# EAGLE schematic comando 24V (EAGLE 9.6.1)

## Sheet 1 of 13
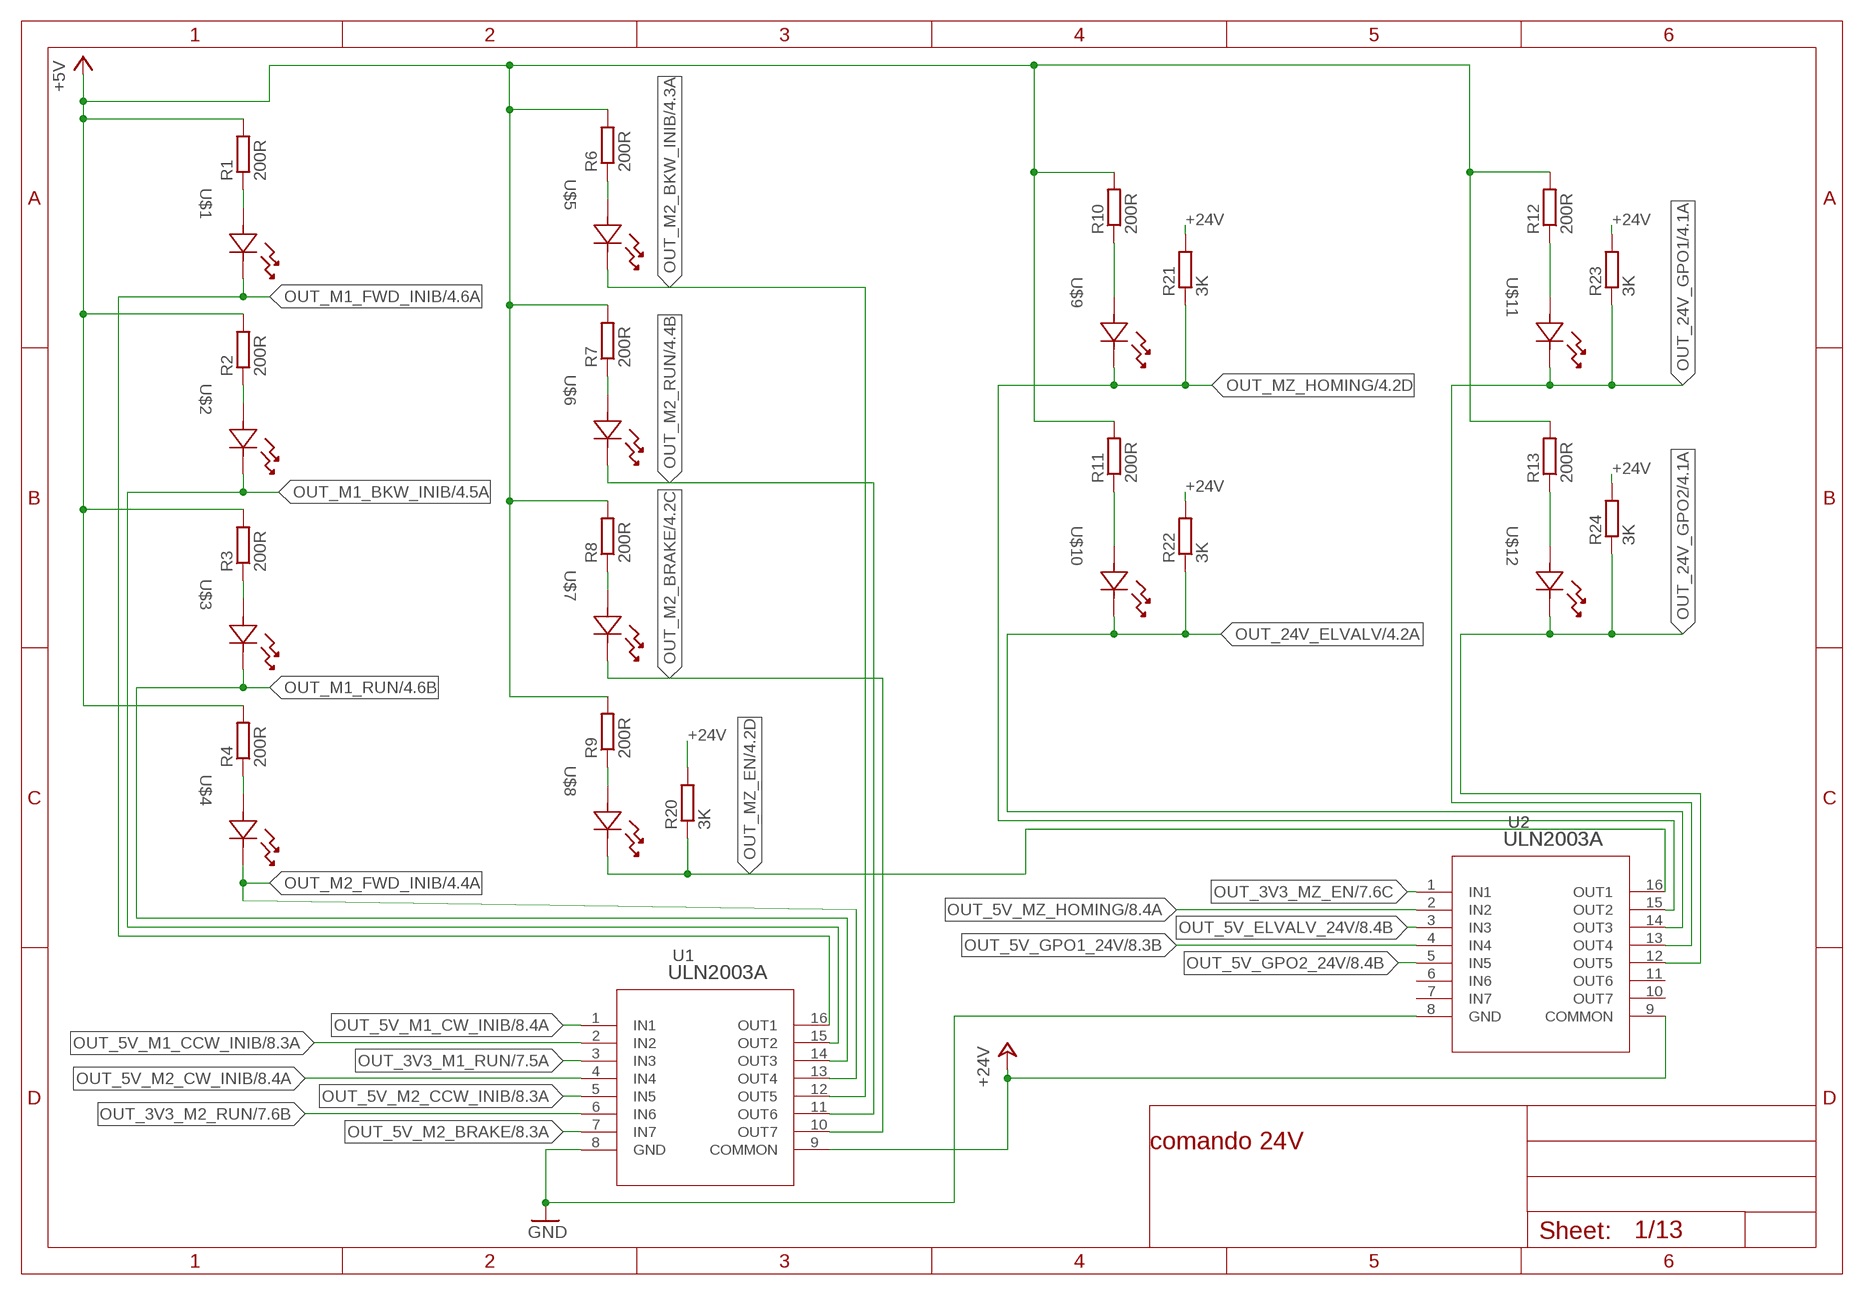
[diagram p0: schematic, sheet 1]

### Parts
R1  200R  R-EU_207/100207/10  [0207/10]
R2  200R  R-EU_207/100207/10  [0207/10]
R3  200R  R-EU_207/100207/10  [0207/10]
R4  200R  R-EU_207/100207/10  [0207/10]
R6  200R  R-EU_207/100207/10  [0207/10]
R7  200R  R-EU_207/100207/10  [0207/10]
R8  200R  R-EU_207/100207/10  [0207/10]
R9  200R  R-EU_207/100207/10  [0207/10]
R10  200R  R-EU_207/100207/10  [0207/10]
R11  200R  R-EU_207/100207/10  [0207/10]
R12  200R  R-EU_207/100207/10  [0207/10]
R13  200R  R-EU_207/100207/10  [0207/10]
R20  3K  R-EU_207/100207/10  [0207/10]
R21  3K  R-EU_207/100207/10  [0207/10]
R22  3K  R-EU_207/100207/10  [0207/10]
R23  3K  R-EU_207/100207/10  [0207/10]
R24  3K  R-EU_207/100207/10  [0207/10]
U1  ULN2003A  [DIP-16_STM]
U2  ULN2003A  [DIP-16_STM]
U$1  LED_TONDO  [LED_TONDO]
U$2  LED_TONDO  [LED_TONDO]
U$3  LED_TONDO  [LED_TONDO]
U$4  LED_TONDO  [LED_TONDO]
U$5  LED_TONDO  [LED_TONDO]
U$6  LED_TONDO  [LED_TONDO]
U$7  LED_TONDO  [LED_TONDO]
U$8  LED_TONDO  [LED_TONDO]
U$9  LED_TONDO  [LED_TONDO]
U$10  LED_TONDO  [LED_TONDO]
U$11  LED_TONDO  [LED_TONDO]
U$12  LED_TONDO  [LED_TONDO]

### Nets
+5V [supply]: R1.2 R2.2 R3.2 R4.2 R6.2 R7.2 R8.2 R9.2 R10.2 R11.2 R12.2 R13.2 ; also sheet 2,3,5,8,9,10,11,12
+24V [supply]: R20.2 R21.2 R22.2 R23.2 R24.2 U1.9(COMMON) U2.9(COMMON) ; also sheet 2,3,4,5,9,10,11
GND [ground]: U1.8(GND) U2.8(GND) ; also sheet 2,3,4,5,6,7,8,9,10,11,12
N$1: R1.1 U$1.2
N$2: R2.1 U$2.2
N$3: R3.1 U$3.2
N$4: R4.1 U$4.2
N$5: R6.1 U$5.2
N$6: R7.1 U$6.2
N$7: R8.1 U$7.2
N$8: R9.1 U$8.2
N$10: R10.1 U$9.2
N$11: R11.1 U$10.2
N$12: R12.1 U$11.2
N$13: R13.1 U$12.2
OUT_3V3_M1_RUN: U1.3(IN3) ; also sheet 7
OUT_3V3_M2_RUN: U1.6(IN6) ; also sheet 7
OUT_3V3_MZ_EN: U2.1(IN1) ; also sheet 7
OUT_5V_ELVALV_24V: U2.3(IN3) ; also sheet 8
OUT_5V_GPO1_24V: U2.4(IN4) ; also sheet 8
OUT_5V_GPO2_24V: U2.5(IN5) ; also sheet 8
OUT_5V_M1_CCW_INIB: U1.2(IN2) ; also sheet 8
OUT_5V_M1_CW_INIB: U1.1(IN1) ; also sheet 8
OUT_5V_M2_BRAKE: U1.7(IN7) ; also sheet 8
OUT_5V_M2_CCW_INIB: U1.5(IN5) ; also sheet 8
OUT_5V_M2_CW_INIB: U1.4(IN4) ; also sheet 8
OUT_5V_MZ_HOMING: U2.2(IN2) ; also sheet 8
OUT_24V_ELVALV: R22.1 U2.14(OUT3) U$10.1 ; also sheet 4
OUT_24V_GPO1: R23.1 U2.13(OUT4) U$11.1 ; also sheet 4
OUT_24V_GPO2: R24.1 U2.12(OUT5) U$12.1 ; also sheet 4
OUT_M1_BKW_INIB: U1.15(OUT2) U$2.1 ; also sheet 4
OUT_M1_FWD_INIB: U1.16(OUT1) U$1.1 ; also sheet 4
OUT_M1_RUN: U1.14(OUT3) U$3.1 ; also sheet 4
OUT_M2_BKW_INIB: U1.12(OUT5) U$5.1 ; also sheet 4
OUT_M2_BRAKE: U1.10(OUT7) U$7.1 ; also sheet 4
OUT_M2_FWD_INIB: U1.13(OUT4) U$4.1 ; also sheet 4
OUT_M2_RUN: U1.11(OUT6) U$6.1 ; also sheet 4
OUT_MZ_EN: R20.1 U2.16(OUT1) U$8.1 ; also sheet 4
OUT_MZ_HOMING: R21.1 U2.15(OUT2) U$9.1 ; also sheet 4
Unconnected: U2.6(IN6) U2.7(IN7) U2.10(OUT7) U2.11(OUT6)

## Sheet 2 of 13
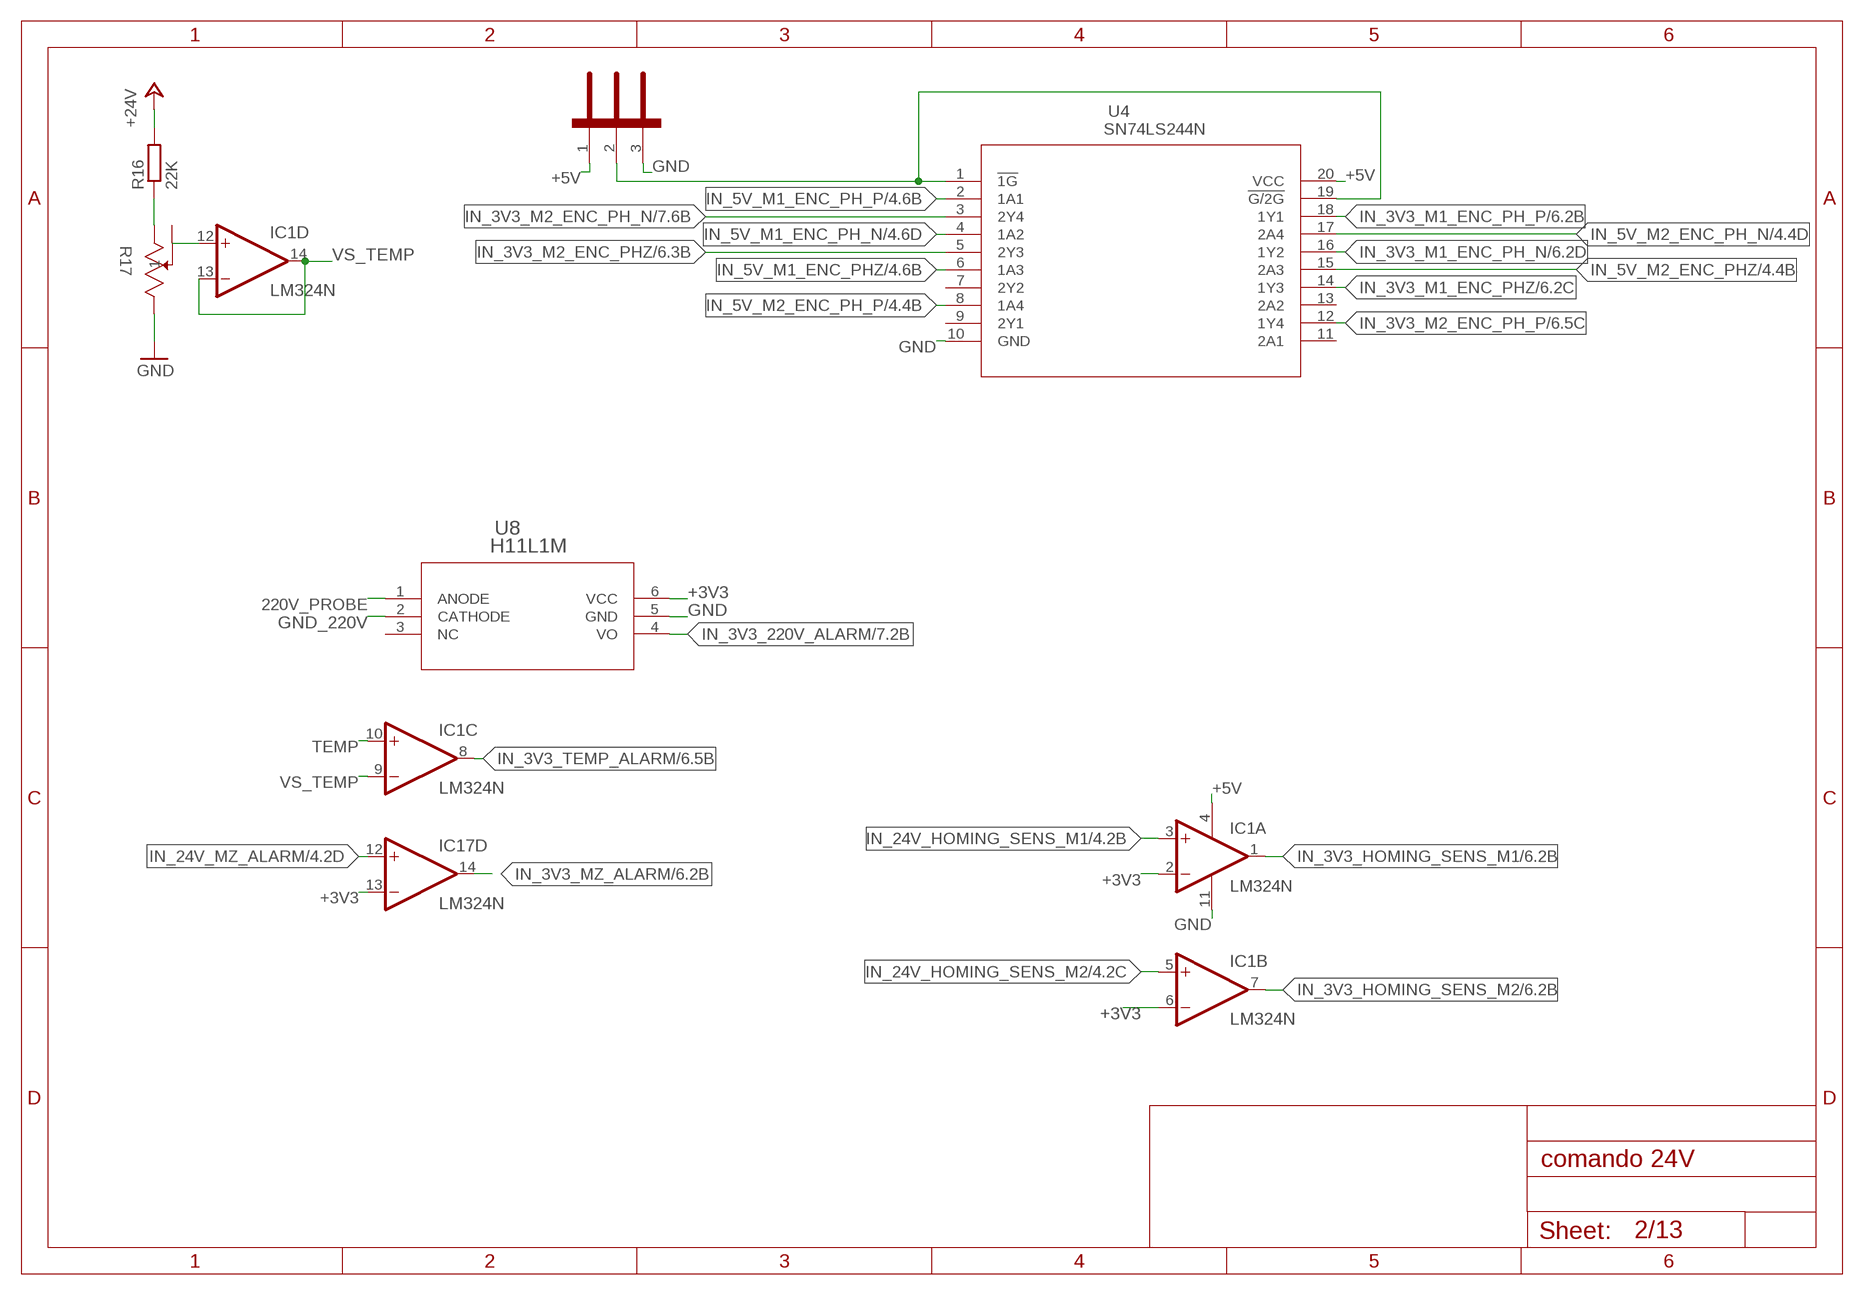
[diagram p1: schematic, sheet 2]

### Parts
EN_IN_ENC  STRIP_3  [STRIP_3]
IC1  LM324N  [DIL14]
IC17  LM324N  [DIL14]
R16  22K  R-EU_207/100207/10  [0207/10]
R17  TEMP_ADJ  64WR5KLF  [RES3_64W_TTE]
U4  SN74LS244N  [N20]
U8  H11L1M  [PDIP6-646BX_ONS]

### Nets
220V_PROBE: U8.1(ANODE) ; also sheet 3
+3V3 [supply]: IC1.2(A:-IN) IC1.6(B:-IN) IC17.13(D:-IN) U8.6(VCC) ; also sheet 3,4
+5V [supply]: EN_IN_ENC.1 IC1.4(P:V+) U4.20(VCC) ; also sheet 1,3,5,8,9,10,11,12
+24V [supply]: R16.2 ; also sheet 1,3,4,5,9,10,11
GND [ground]: EN_IN_ENC.3 IC1.11(P:V-) R17.3 U4.10(GND) U8.5(GND) ; also sheet 1,3,4,5,6,7,8,9,10,11,12
GND_220V [ground]: U8.2(CATHODE) ; also sheet 3
IN_3V3_220V_ALARM: U8.4(VO) ; also sheet 7
IN_3V3_HOMING_SENS_M1: IC1.1(A:OUT) ; also sheet 6
IN_3V3_HOMING_SENS_M2: IC1.7(B:OUT) ; also sheet 6
IN_3V3_M1_ENC_PH_N [high speed]: U4.16(1Y2) ; also sheet 6
IN_3V3_M1_ENC_PH_P [high speed]: U4.18(1Y1) ; also sheet 6
IN_3V3_M1_ENC_PHZ [high speed]: U4.14(1Y3) ; also sheet 6
IN_3V3_M2_ENC_PH_N [high speed]: U4.3(2Y4) ; also sheet 7
IN_3V3_M2_ENC_PH_P [high speed]: U4.12(1Y4) ; also sheet 6
IN_3V3_M2_ENC_PHZ [high speed]: U4.5(2Y3) ; also sheet 6
IN_3V3_MZ_ALARM: IC17.14(D:OUT) ; also sheet 6
IN_3V3_TEMP_ALARM: IC1.8(C:OUT) ; also sheet 6
IN_5V_M1_ENC_PH_N [high speed]: U4.4(1A2) ; also sheet 4
IN_5V_M1_ENC_PH_P [high speed]: U4.2(1A1) ; also sheet 4
IN_5V_M1_ENC_PHZ [high speed]: U4.6(1A3) ; also sheet 4
IN_5V_M2_ENC_PH_N [high speed]: U4.17(2A4) ; also sheet 4
IN_5V_M2_ENC_PH_P [high speed]: U4.8(1A4) ; also sheet 4
IN_5V_M2_ENC_PHZ [high speed]: U4.15(2A3) ; also sheet 4
IN_24V_HOMING_SENS_M1: IC1.3(A:+IN) ; also sheet 4
IN_24V_HOMING_SENS_M2: IC1.5(B:+IN) ; also sheet 4
IN_24V_MZ_ALARM: IC17.12(D:+IN) ; also sheet 4
N$14: R16.1 R17.1
N$32: IC1.12(D:+IN) R17.2
N$43: EN_IN_ENC.2 U4.1(!1G) U4.19(!G/2G)
TEMP: IC1.10(C:+IN) ; also sheet 3
VS_TEMP: IC1.9(C:-IN) IC1.13(D:-IN) IC1.14(D:OUT)
Unconnected: U4.7(2Y2) U4.9(2Y1) U4.11(2A1) U4.13(2A2) U8.3(NC)

## Sheet 3 of 13
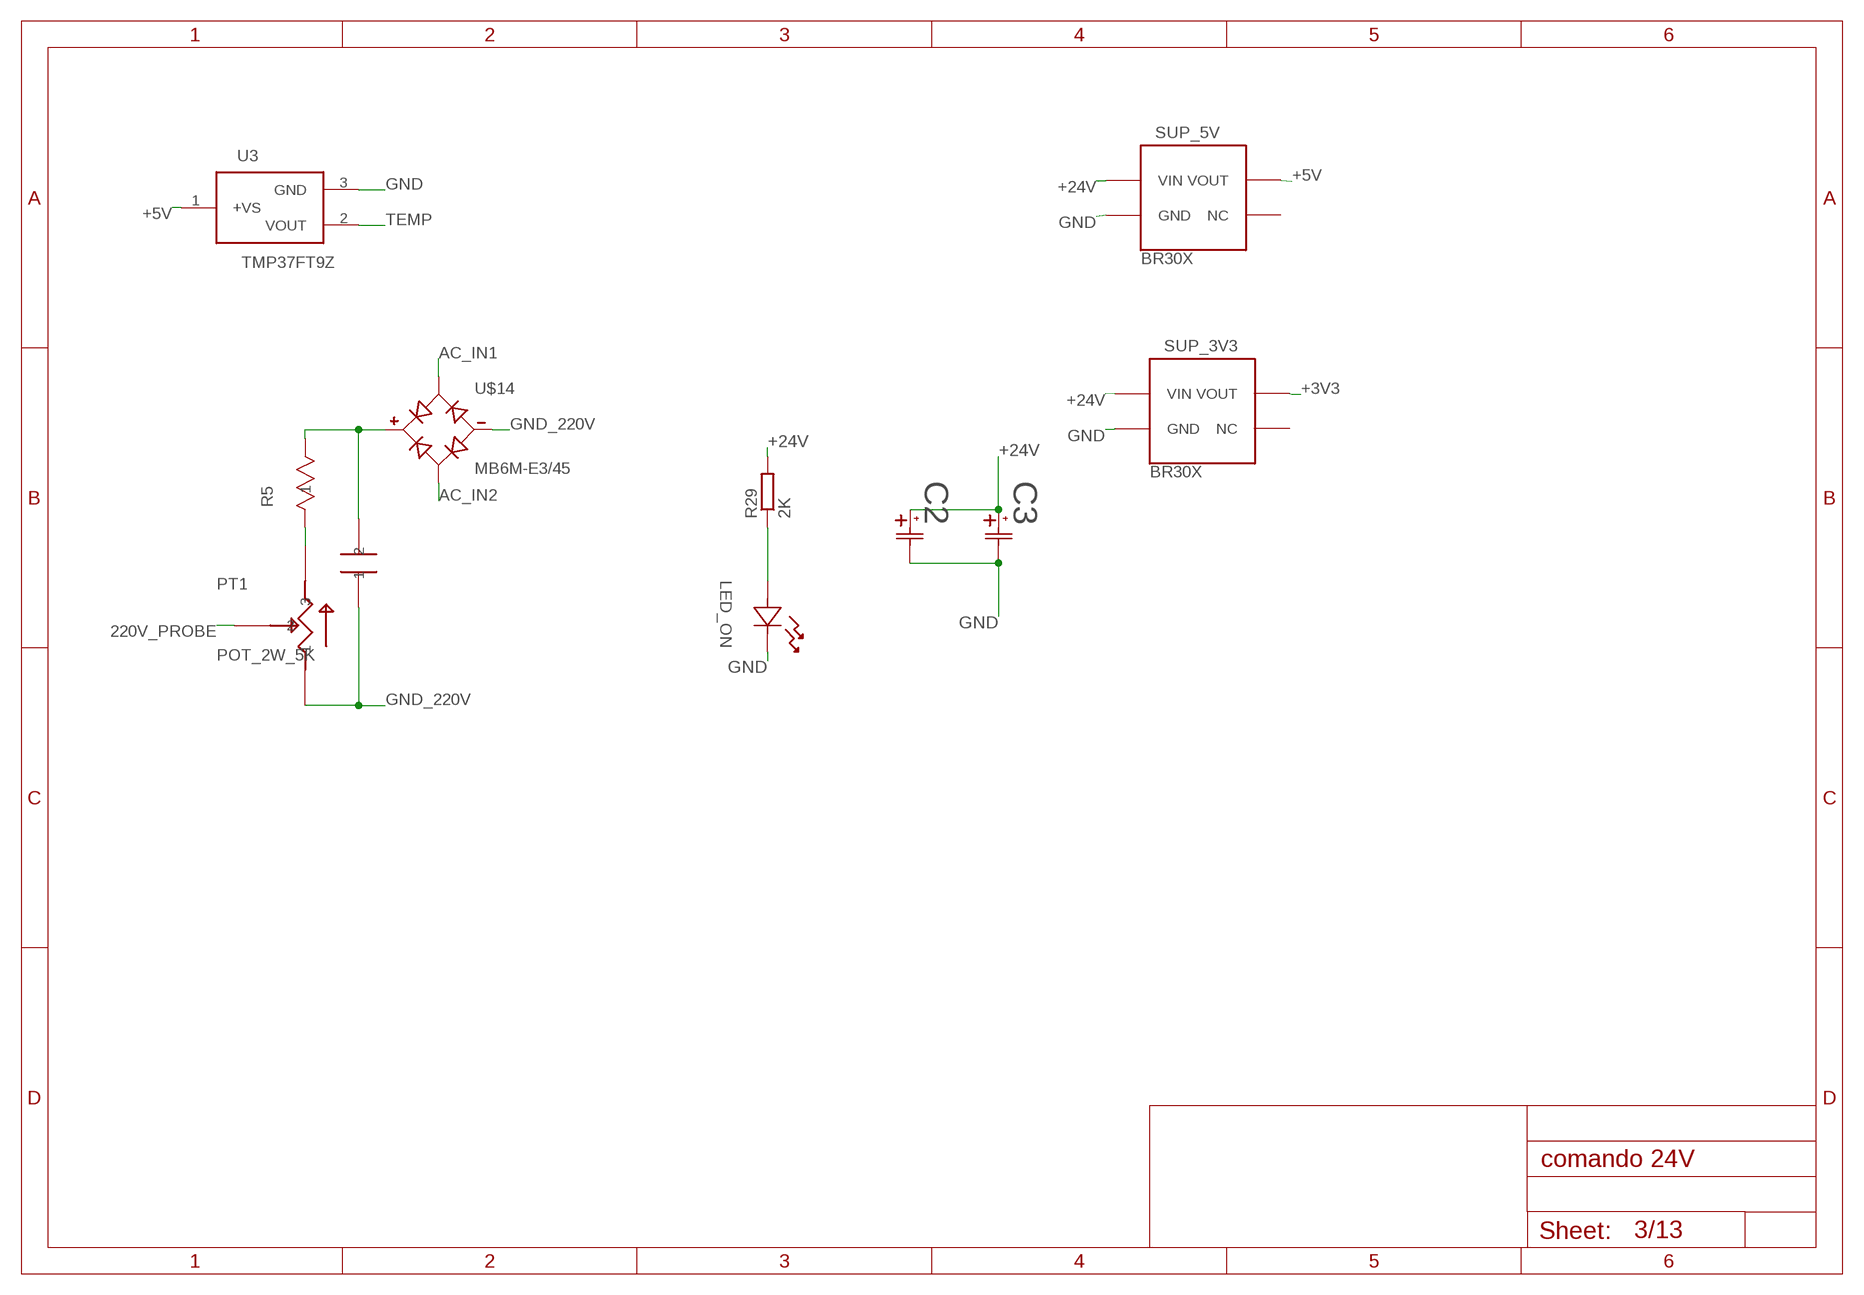
[diagram p2: schematic, sheet 3]

### Parts
C2  QYX1H102JTP3TA  [CAP_QYX_2P5X5X8P5_NCH]
C3  UBY2A301MHL  [CAP_UBY_12P5X31P5_NCH]
PT1  POT_2W_5K  [POT_2W_5K]
R5  OY104KE  [RES_OY_OHM]
R29  2K  R-EU_207/100207/10  [0207/10]
SUP_3V3  BR30X  [BR30X]
SUP_5V  BR30X  [BR30X]
U3  TMP37FT9Z  [T_3_ADI]
U$13  C0U12F  [C0U12F]
U$14  MB6M-E3/45  [DIP508W58P254L483H270Q4]
U$15  LED_ON  LED_TONDO  [LED_TONDO]

### Nets
220V_PROBE: PT1.2 ; also sheet 2
+3V3 [supply]: SUP_3V3.VOUT ; also sheet 2,4
+5V [supply]: SUP_5V.VOUT U3.1(+VS) ; also sheet 1,2,5,8,9,10,11,12
+24V [supply]: C2.1 C3.1 R29.2 SUP_3V3.VIN SUP_5V.VIN ; also sheet 1,2,4,5,9,10,11
AC_IN1 [supply]: U$14.3(AC1) ; also sheet 4
AC_IN2 [supply]: U$14.4(AC2) ; also sheet 4
GND [ground]: C2.2 C3.2 SUP_3V3.GND SUP_5V.GND U3.3(GND) U$15.1 ; also sheet 1,2,4,5,6,7,8,9,10,11,12
GND_220V [ground]: PT1.1 U$13.P$2 U$14.2(-) ; also sheet 2
N$9 [high speed]: R5.2 U$13.P$1 U$14.1(+)
N$21: R29.1 U$15.2
N$23: PT1.3 R5.1
TEMP: U3.2(VOUT) ; also sheet 2
Unconnected: SUP_3V3.NC SUP_5V.NC

## Sheet 4 of 13
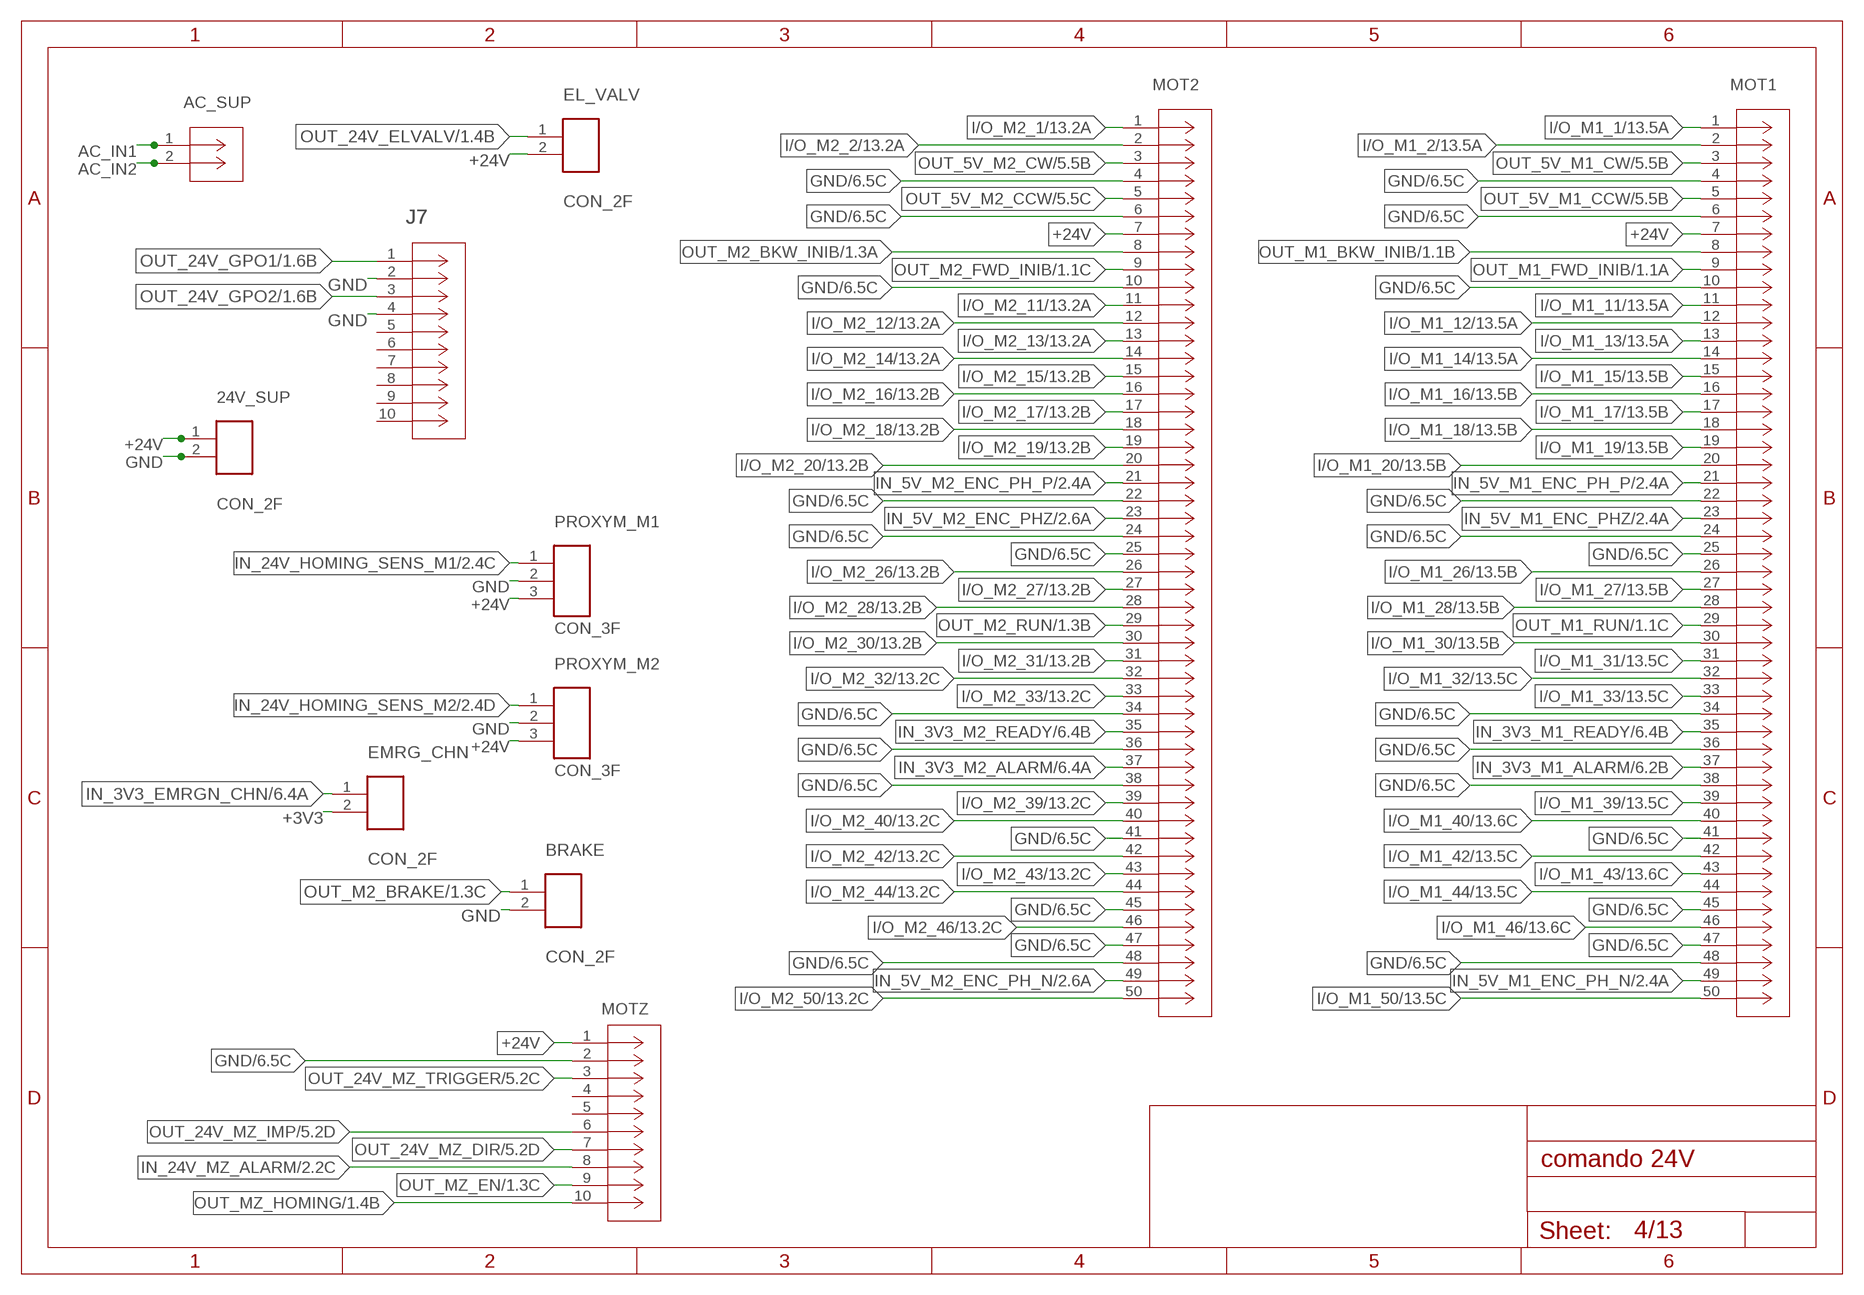
[diagram p3: schematic, sheet 4]

### Parts
24V_SUP  CON_2F  [CON_2F]
AC_SUP  B2B-XH-A(LF)(SN)  [CONN_B2B-XH-A(LF)(SN)_JST]
BRAKE  CON_2F  [CON_2F]
EL_VALV  CON_2F  [CON_2F]
EMRG_CHN  CON_2F  [CON_2F]
J7  61201021621  [CONN_61201021621_WRE]
MOT1  SBH11-PBPC-D25-ST-BK  [CONN_SBH11-PBPC-D25-ST-BK_SUL]
MOT2  SBH11-PBPC-D25-ST-BK  [CONN_SBH11-PBPC-D25-ST-BK_SUL]
MOTZ  61201021621  [CONN_61201021621_WRE]
PROXYM_M1  CON_3F  [CON_3F]
PROXYM_M2  CON_3F  [CON_3F]

### Nets
+3V3 [supply]: EMRG_CHN.2 ; also sheet 2,3
+24V [supply]: 24V_SUP.1 EL_VALV.2 MOT1.7 MOT2.7 MOTZ.1 PROXYM_M1.3 PROXYM_M2.3 ; also sheet 1,2,3,5,9,10,11
AC_IN1 [supply]: AC_SUP.1 ; also sheet 3
AC_IN2 [supply]: AC_SUP.2 ; also sheet 3
GND [ground]: 24V_SUP.2 BRAKE.2 J7.2 J7.4 MOT1.4 MOT1.6 MOT1.10 MOT1.22 MOT1.24 MOT1.25 MOT1.34 MOT1.36 MOT1.38 MOT1.41 MOT1.45 MOT1.47 MOT1.48 MOT2.4 MOT2.6 MOT2.10 MOT2.22 MOT2.24 MOT2.25 MOT2.34 MOT2.36 MOT2.38 MOT2.41 MOT2.45 MOT2.47 MOT2.48 MOTZ.2 PROXYM_M1.2 PROXYM_M2.2 ; also sheet 1,2,3,5,6,7,8,9,10,11,12
I/O_M1_1: MOT1.1 ; also sheet 13
I/O_M1_2: MOT1.2 ; also sheet 13
I/O_M1_11: MOT1.11 ; also sheet 13
I/O_M1_12: MOT1.12 ; also sheet 13
I/O_M1_13: MOT1.13 ; also sheet 13
I/O_M1_14: MOT1.14 ; also sheet 13
I/O_M1_15: MOT1.15 ; also sheet 13
I/O_M1_16: MOT1.16 ; also sheet 13
I/O_M1_17: MOT1.17 ; also sheet 13
I/O_M1_18: MOT1.18 ; also sheet 13
I/O_M1_19: MOT1.19 ; also sheet 13
I/O_M1_20: MOT1.20 ; also sheet 13
I/O_M1_26: MOT1.26 ; also sheet 13
I/O_M1_27: MOT1.27 ; also sheet 13
I/O_M1_28: MOT1.28 ; also sheet 13
I/O_M1_30: MOT1.30 ; also sheet 13
I/O_M1_31: MOT1.31 ; also sheet 13
I/O_M1_32: MOT1.32 ; also sheet 13
I/O_M1_33: MOT1.33 ; also sheet 13
I/O_M1_39: MOT1.39 ; also sheet 13
I/O_M1_40: MOT1.40 ; also sheet 13
I/O_M1_42: MOT1.42 ; also sheet 13
I/O_M1_43: MOT1.43 ; also sheet 13
I/O_M1_44: MOT1.44 ; also sheet 13
I/O_M1_46: MOT1.46 ; also sheet 13
I/O_M1_50: MOT1.50 ; also sheet 13
I/O_M2_1: MOT2.1 ; also sheet 13
I/O_M2_2: MOT2.2 ; also sheet 13
I/O_M2_11: MOT2.11 ; also sheet 13
I/O_M2_12: MOT2.12 ; also sheet 13
I/O_M2_13: MOT2.13 ; also sheet 13
I/O_M2_14: MOT2.14 ; also sheet 13
I/O_M2_15: MOT2.15 ; also sheet 13
I/O_M2_16: MOT2.16 ; also sheet 13
I/O_M2_17: MOT2.17 ; also sheet 13
I/O_M2_18: MOT2.18 ; also sheet 13
I/O_M2_19: MOT2.19 ; also sheet 13
I/O_M2_20: MOT2.20 ; also sheet 13
I/O_M2_26: MOT2.26 ; also sheet 13
I/O_M2_27: MOT2.27 ; also sheet 13
I/O_M2_28: MOT2.28 ; also sheet 13
I/O_M2_30: MOT2.30 ; also sheet 13
I/O_M2_31: MOT2.31 ; also sheet 13
I/O_M2_32: MOT2.32 ; also sheet 13
I/O_M2_33: MOT2.33 ; also sheet 13
I/O_M2_39: MOT2.39 ; also sheet 13
I/O_M2_40: MOT2.40 ; also sheet 13
I/O_M2_42: MOT2.42 ; also sheet 13
I/O_M2_43: MOT2.43 ; also sheet 13
I/O_M2_44: MOT2.44 ; also sheet 13
I/O_M2_46: MOT2.46 ; also sheet 13
I/O_M2_50: MOT2.50 ; also sheet 13
IN_3V3_EMRGN_CHN: EMRG_CHN.1 ; also sheet 6,7
IN_3V3_M1_ALARM: MOT1.37 ; also sheet 6
IN_3V3_M1_READY: MOT1.35 ; also sheet 6
IN_3V3_M2_ALARM: MOT2.37 ; also sheet 6
IN_3V3_M2_READY: MOT2.35 ; also sheet 6
IN_5V_M1_ENC_PH_N [high speed]: MOT1.49 ; also sheet 2
IN_5V_M1_ENC_PH_P [high speed]: MOT1.21 ; also sheet 2
IN_5V_M1_ENC_PHZ [high speed]: MOT1.23 ; also sheet 2
IN_5V_M2_ENC_PH_N [high speed]: MOT2.49 ; also sheet 2
IN_5V_M2_ENC_PH_P [high speed]: MOT2.21 ; also sheet 2
IN_5V_M2_ENC_PHZ [high speed]: MOT2.23 ; also sheet 2
IN_24V_HOMING_SENS_M1: PROXYM_M1.1 ; also sheet 2
IN_24V_HOMING_SENS_M2: PROXYM_M2.1 ; also sheet 2
IN_24V_MZ_ALARM: MOTZ.8 ; also sheet 2
OUT_5V_M1_CCW [high speed]: MOT1.5 ; also sheet 5
OUT_5V_M1_CW [high speed]: MOT1.3 ; also sheet 5
OUT_5V_M2_CCW [high speed]: MOT2.5 ; also sheet 5
OUT_5V_M2_CW [high speed]: MOT2.3 ; also sheet 5
OUT_24V_ELVALV: EL_VALV.1 ; also sheet 1
OUT_24V_GPO1: J7.1 ; also sheet 1
OUT_24V_GPO2: J7.3 ; also sheet 1
OUT_24V_MZ_DIR [mid speed]: MOTZ.7 ; also sheet 5
OUT_24V_MZ_IMP [mid speed]: MOTZ.6 ; also sheet 5
OUT_24V_MZ_TRIGGER: MOTZ.3 ; also sheet 5
OUT_M1_BKW_INIB: MOT1.8 ; also sheet 1
OUT_M1_FWD_INIB: MOT1.9 ; also sheet 1
OUT_M1_RUN: MOT1.29 ; also sheet 1
OUT_M2_BKW_INIB: MOT2.8 ; also sheet 1
OUT_M2_BRAKE: BRAKE.1 ; also sheet 1
OUT_M2_FWD_INIB: MOT2.9 ; also sheet 1
OUT_M2_RUN: MOT2.29 ; also sheet 1
OUT_MZ_EN: MOTZ.9 ; also sheet 1
OUT_MZ_HOMING: MOTZ.10 ; also sheet 1
Unconnected: J7.5 J7.6 J7.7 J7.8 J7.9 J7.10 MOTZ.4 MOTZ.5

## Sheet 5 of 13
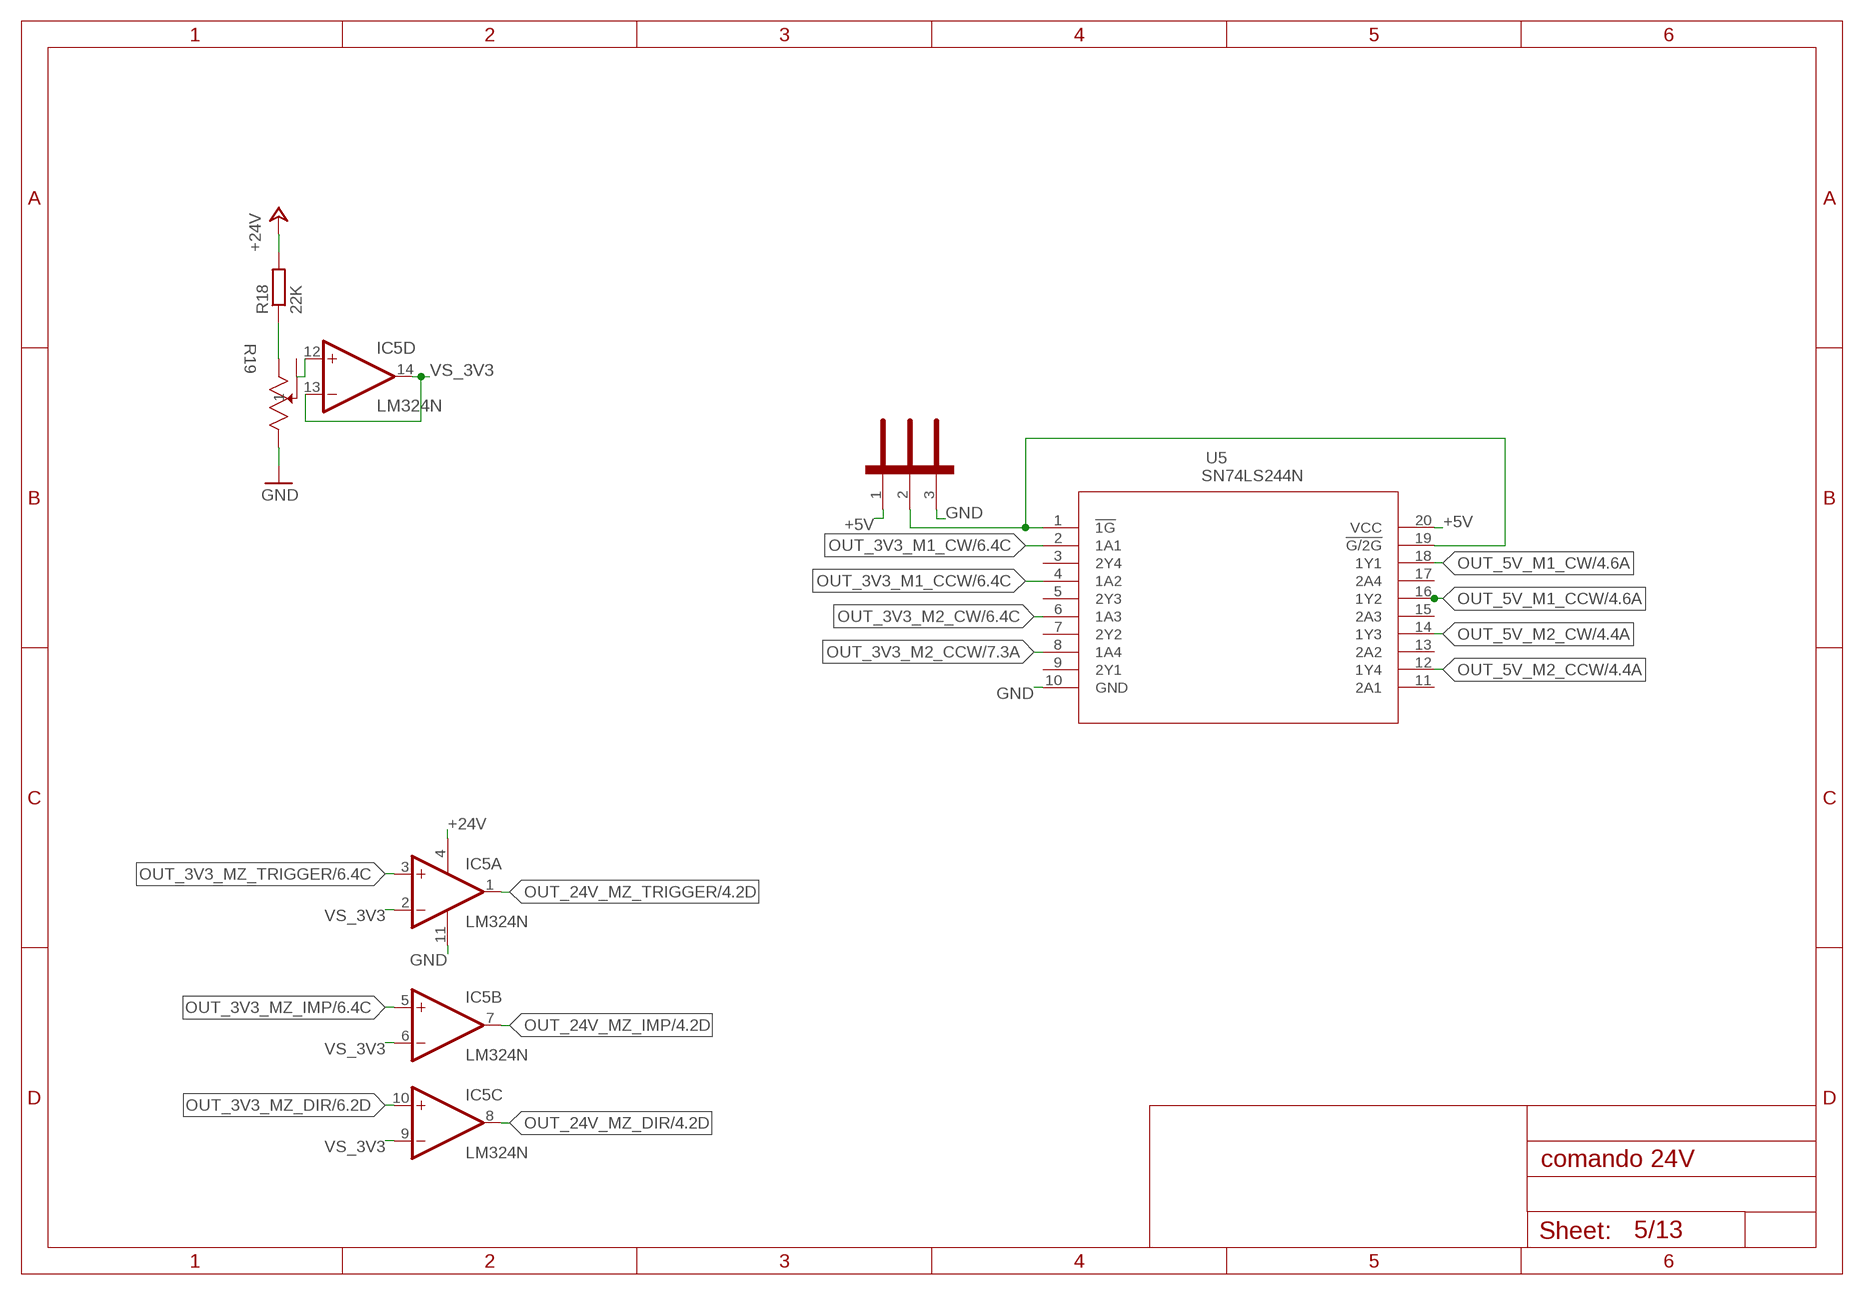
[diagram p4: schematic, sheet 5]

### Parts
EN_OUT_MOT  STRIP_3  [STRIP_3]
IC5  LM324N  [DIL14]
R18  22K  R-EU_207/100207/10  [0207/10]
R19  VS_3V3_ADJ  64WR5KLF  [RES3_64W_TTE]
U5  SN74LS244N  [N20]

### Nets
+5V [supply]: EN_OUT_MOT.1 U5.20(VCC) ; also sheet 1,2,3,8,9,10,11,12
+24V [supply]: IC5.4(P:V+) R18.2 ; also sheet 1,2,3,4,9,10,11
GND [ground]: EN_OUT_MOT.3 IC5.11(P:V-) R19.3 U5.10(GND) ; also sheet 1,2,3,4,6,7,8,9,10,11,12
N$16: EN_OUT_MOT.2 U5.1(!1G) U5.19(!G/2G)
N$29: IC5.12(D:+IN) R19.2
N$31: R18.1 R19.1
OUT_3V3_M1_CCW [high speed]: U5.4(1A2) ; also sheet 6
OUT_3V3_M1_CW [high speed]: U5.2(1A1) ; also sheet 6
OUT_3V3_M2_CCW [high speed]: U5.8(1A4) ; also sheet 7
OUT_3V3_M2_CW [high speed]: U5.6(1A3) ; also sheet 6
OUT_3V3_MZ_DIR [mid speed]: IC5.10(C:+IN) ; also sheet 6
OUT_3V3_MZ_IMP [mid speed]: IC5.5(B:+IN) ; also sheet 6
OUT_3V3_MZ_TRIGGER: IC5.3(A:+IN) ; also sheet 6
OUT_5V_M1_CCW [high speed]: U5.16(1Y2) ; also sheet 4
OUT_5V_M1_CW [high speed]: U5.18(1Y1) ; also sheet 4
OUT_5V_M2_CCW [high speed]: U5.12(1Y4) ; also sheet 4
OUT_5V_M2_CW [high speed]: U5.14(1Y3) ; also sheet 4
OUT_24V_MZ_DIR [mid speed]: IC5.8(C:OUT) ; also sheet 4
OUT_24V_MZ_IMP [mid speed]: IC5.7(B:OUT) ; also sheet 4
OUT_24V_MZ_TRIGGER: IC5.1(A:OUT) ; also sheet 4
VS_3V3: IC5.2(A:-IN) IC5.6(B:-IN) IC5.9(C:-IN) IC5.13(D:-IN) IC5.14(D:OUT)
Unconnected: U5.3(2Y4) U5.5(2Y3) U5.7(2Y2) U5.9(2Y1) U5.11(2A1) U5.13(2A2) U5.15(2A3) U5.17(2A4)

## Sheet 6 of 13
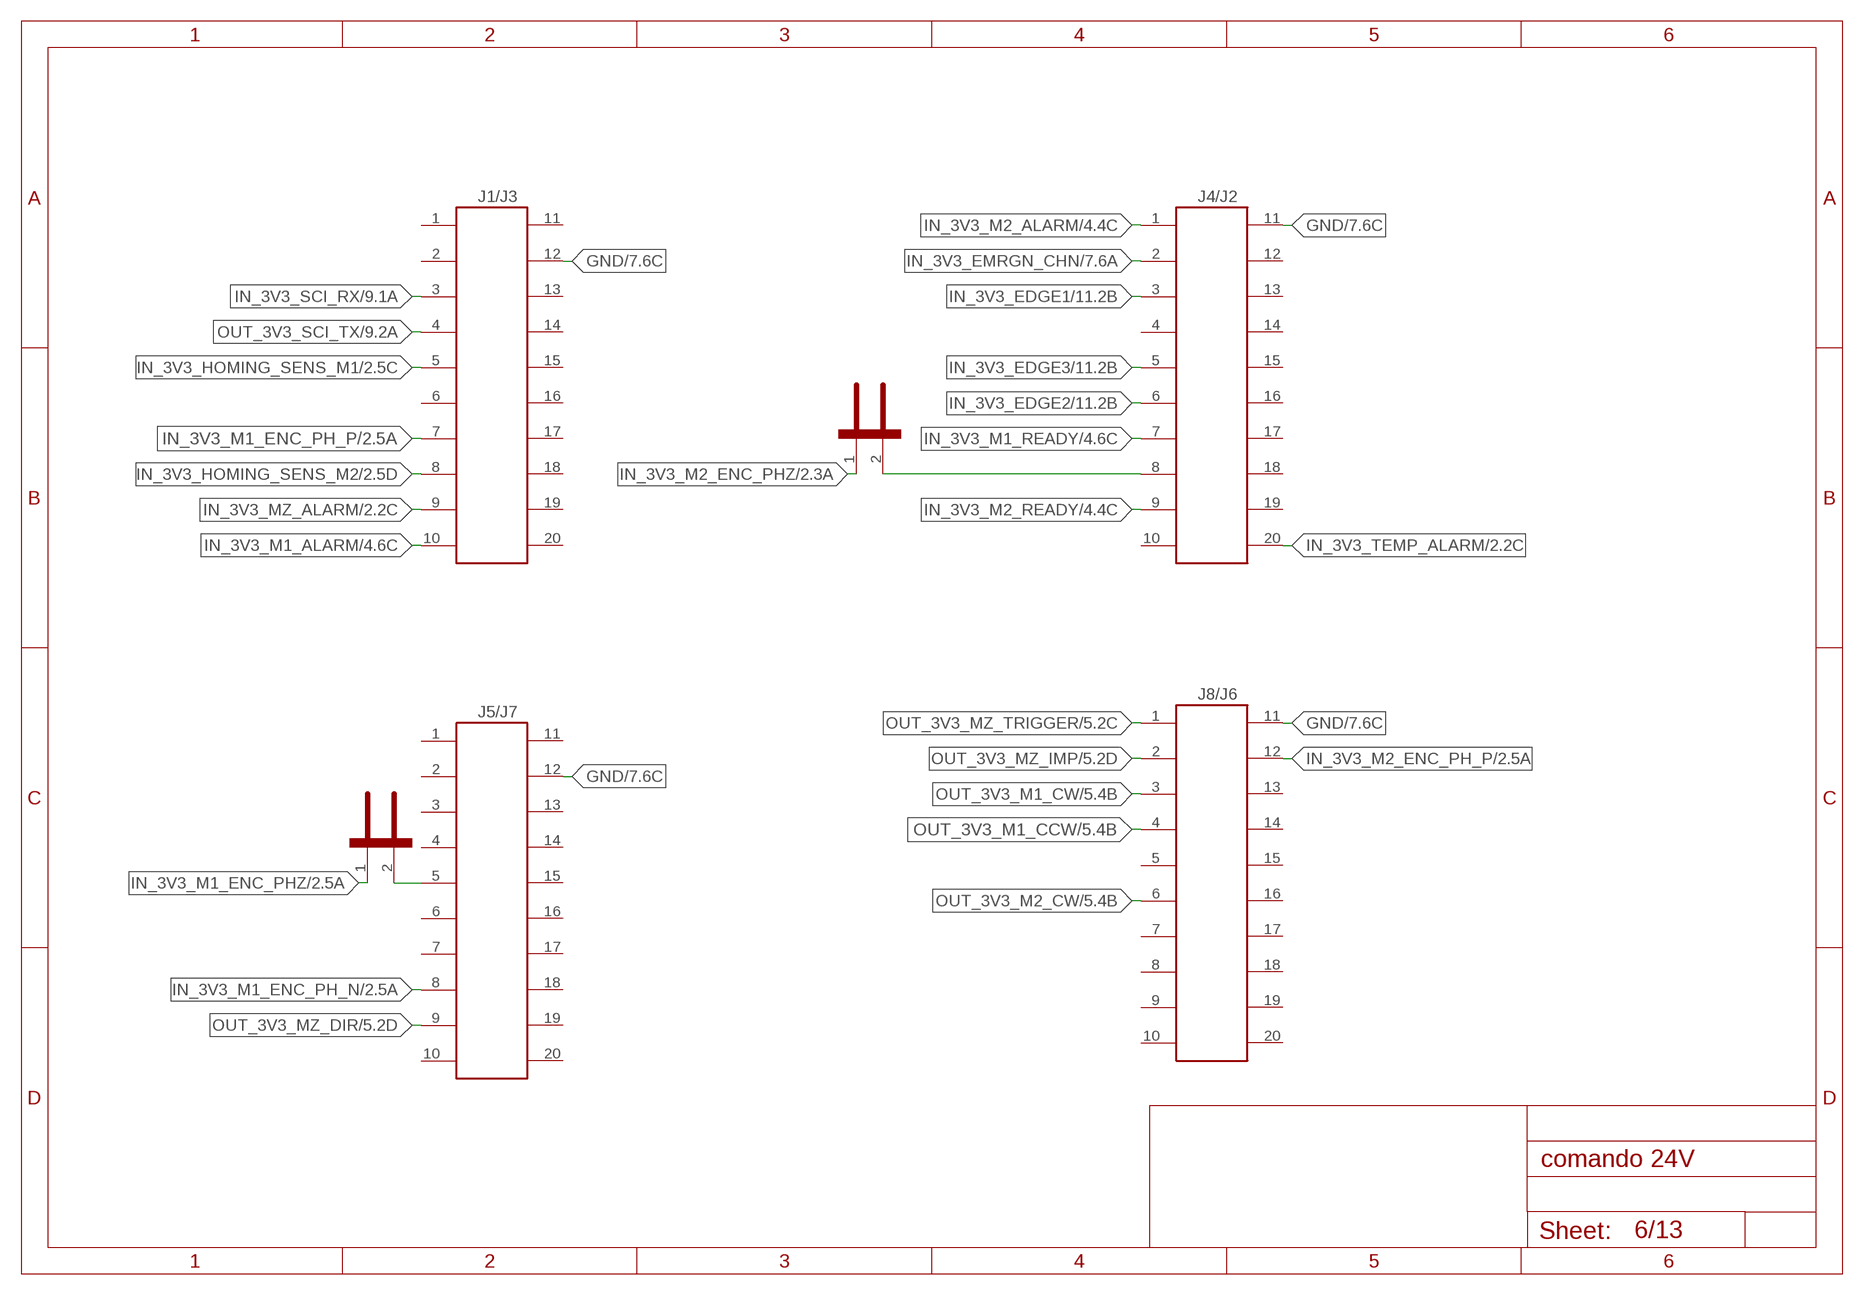
[diagram p5: schematic, sheet 6]

### Parts
EN_M1_ENC_PHZ  STRIP_2  [STRIP_2]
EN_M2_ENC_PHZ  STRIP_2  [STRIP_2]
J1/J3  61202021621  [61202021621]
J4/J2  61202021621  [61202021621]
J5/J7  61202021621  [61202021621]
J8/J6  61202021621  [61202021621]

### Nets
GND [ground]: J1/J3.12 J4/J2.11 J5/J7.12 J8/J6.11 ; also sheet 1,2,3,4,5,7,8,9,10,11,12
IN_3V3_EDGE1: J4/J2.3 ; also sheet 11
IN_3V3_EDGE2: J4/J2.6 ; also sheet 11
IN_3V3_EDGE3: J4/J2.5 ; also sheet 11
IN_3V3_EMRGN_CHN: J4/J2.2 ; also sheet 4,7
IN_3V3_HOMING_SENS_M1: J1/J3.5 ; also sheet 2
IN_3V3_HOMING_SENS_M2: J1/J3.8 ; also sheet 2
IN_3V3_M1_ALARM: J1/J3.10 ; also sheet 4
IN_3V3_M1_ENC_PH_N [high speed]: J5/J7.8 ; also sheet 2
IN_3V3_M1_ENC_PH_P [high speed]: J1/J3.7 ; also sheet 2
IN_3V3_M1_ENC_PHZ [high speed]: EN_M1_ENC_PHZ.1 ; also sheet 2
IN_3V3_M1_READY: J4/J2.7 ; also sheet 4
IN_3V3_M2_ALARM: J4/J2.1 ; also sheet 4
IN_3V3_M2_ENC_PH_P [high speed]: J8/J6.12 ; also sheet 2
IN_3V3_M2_ENC_PHZ [high speed]: EN_M2_ENC_PHZ.1 ; also sheet 2
IN_3V3_M2_READY: J4/J2.9 ; also sheet 4
IN_3V3_MZ_ALARM: J1/J3.9 ; also sheet 2
IN_3V3_SCI_RX [high speed]: J1/J3.3 ; also sheet 9
IN_3V3_TEMP_ALARM: J4/J2.20 ; also sheet 2
N$24: EN_M2_ENC_PHZ.2 J4/J2.8
N$28: EN_M1_ENC_PHZ.2 J5/J7.5
OUT_3V3_M1_CCW [high speed]: J8/J6.4 ; also sheet 5
OUT_3V3_M1_CW [high speed]: J8/J6.3 ; also sheet 5
OUT_3V3_M2_CW [high speed]: J8/J6.6 ; also sheet 5
OUT_3V3_MZ_DIR [mid speed]: J5/J7.9 ; also sheet 5
OUT_3V3_MZ_IMP [mid speed]: J8/J6.2 ; also sheet 5
OUT_3V3_MZ_TRIGGER: J8/J6.1 ; also sheet 5
OUT_3V3_SCI_TX [high speed]: J1/J3.4 ; also sheet 9
Unconnected: J1/J3.1 J1/J3.2 J1/J3.6 J1/J3.11 J1/J3.13 J1/J3.14 J1/J3.15 J1/J3.16 J1/J3.17 J1/J3.18 J1/J3.19 J1/J3.20 J4/J2.4 J4/J2.10 J4/J2.12 J4/J2.13 J4/J2.14 J4/J2.15 J4/J2.16 J4/J2.17 J4/J2.18 J4/J2.19 J5/J7.1 J5/J7.2 J5/J7.3 J5/J7.4 J5/J7.6 J5/J7.7 J5/J7.10 J5/J7.11 J5/J7.13 J5/J7.14 J5/J7.15 J5/J7.16 J5/J7.17 J5/J7.18 J5/J7.19 J5/J7.20 J8/J6.5 J8/J6.7 J8/J6.8 J8/J6.9 J8/J6.10 J8/J6.13 J8/J6.14 J8/J6.15 J8/J6.16 J8/J6.17 J8/J6.18 J8/J6.19 J8/J6.20

## Sheet 7 of 13
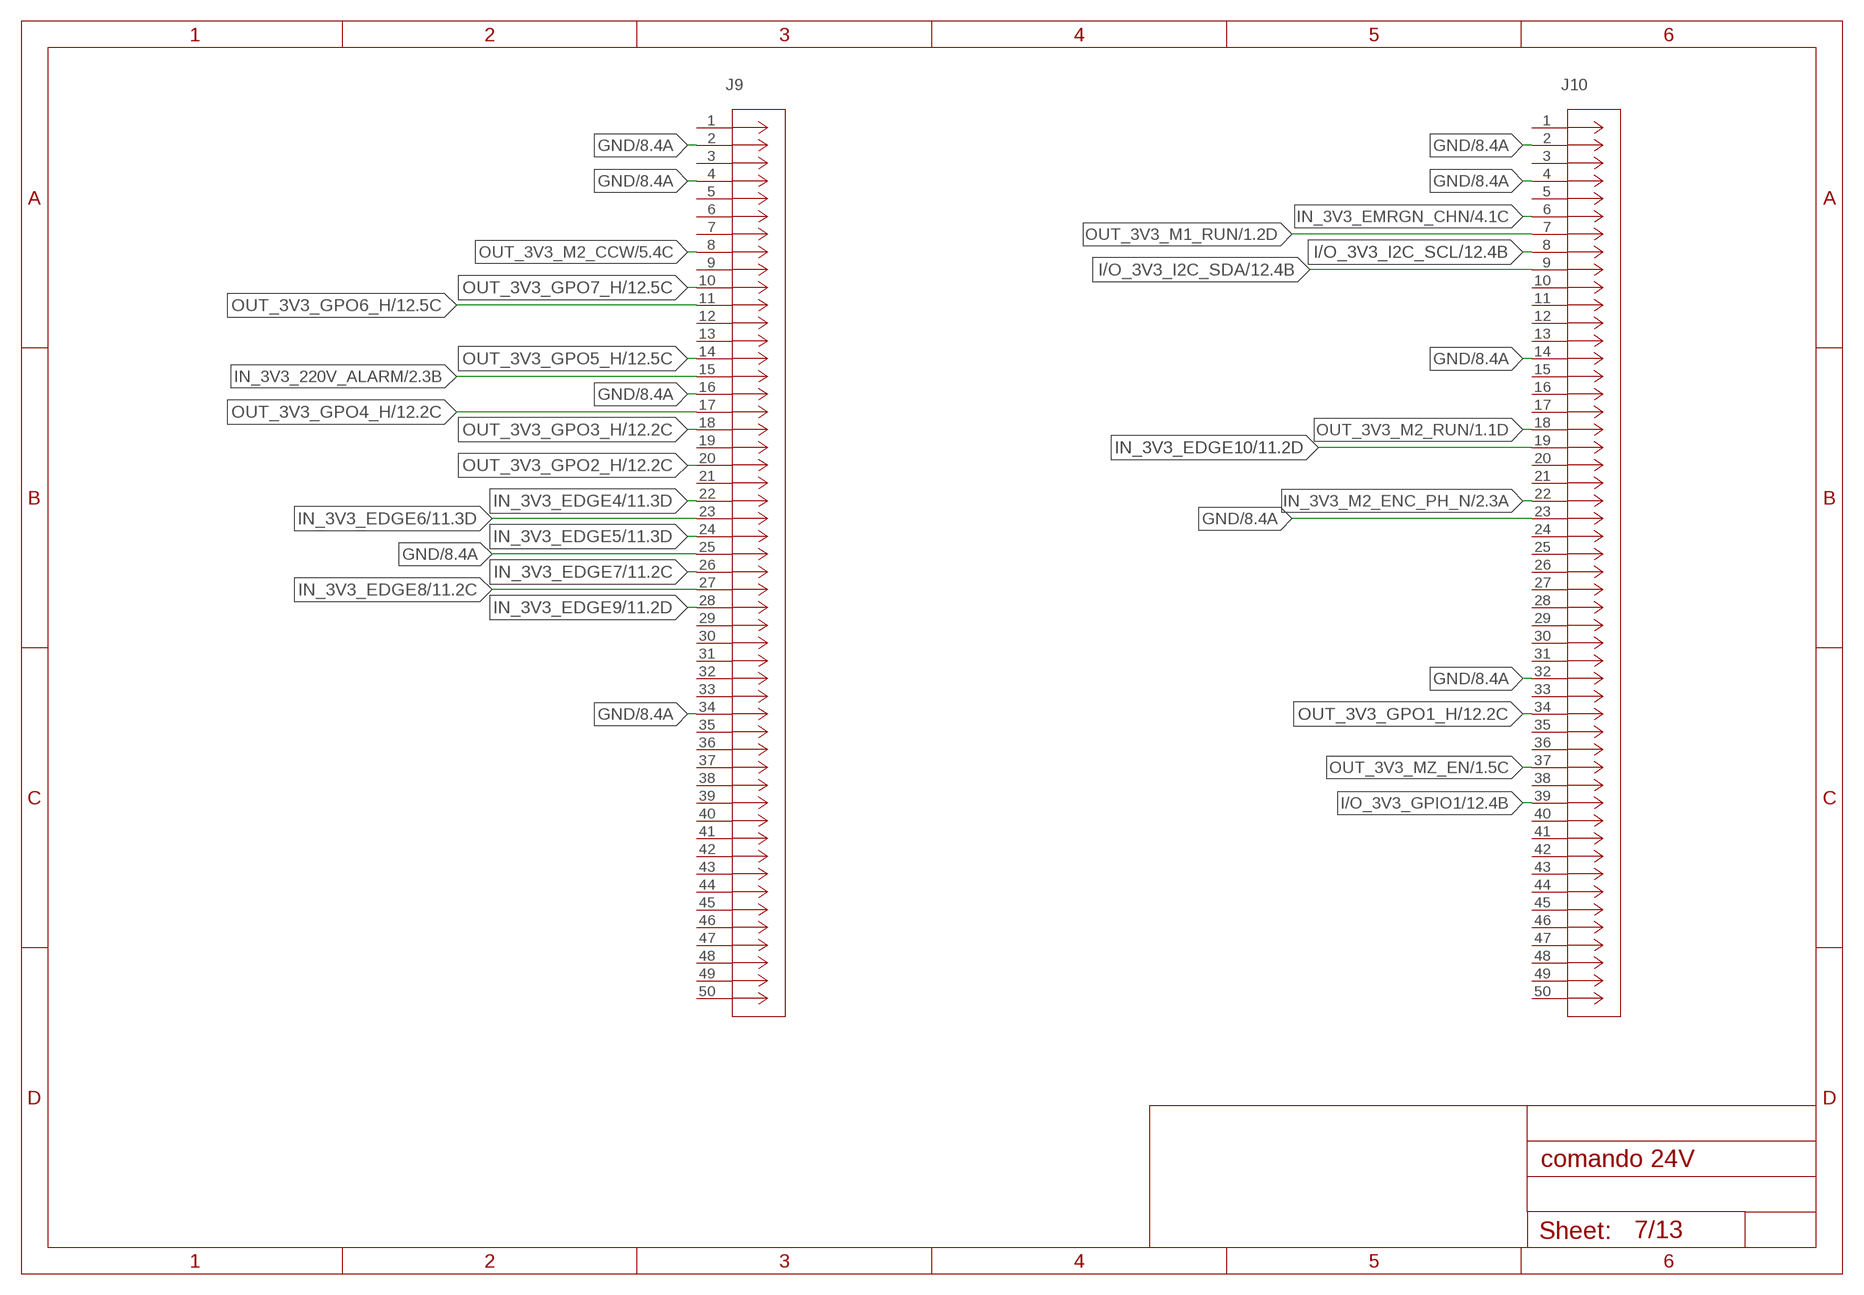
[diagram p6: schematic, sheet 7]

### Parts
J9  SBH11-PBPC-D25-ST-BK  [CONN_SBH11-PBPC-D25-ST-BK_SUL]
J10  SBH11-PBPC-D25-ST-BK  [CONN_SBH11-PBPC-D25-ST-BK_SUL]

### Nets
GND [ground]: J9.2 J9.4 J9.16 J9.25 J9.34 J10.2 J10.4 J10.14 J10.23 J10.32 ; also sheet 1,2,3,4,5,6,8,9,10,11,12
I/O_3V3_GPIO1: J10.39 ; also sheet 12
I/O_3V3_I2C_SCL [high speed]: J10.8 ; also sheet 12
I/O_3V3_I2C_SDA [high speed]: J10.9 ; also sheet 12
IN_3V3_220V_ALARM: J9.15 ; also sheet 2
IN_3V3_EDGE4: J9.22 ; also sheet 11
IN_3V3_EDGE5: J9.24 ; also sheet 11
IN_3V3_EDGE6: J9.23 ; also sheet 11
IN_3V3_EDGE7: J9.26 ; also sheet 11
IN_3V3_EDGE8: J9.27 ; also sheet 11
IN_3V3_EDGE9: J9.28 ; also sheet 11
IN_3V3_EDGE10: J10.19 ; also sheet 11
IN_3V3_EMRGN_CHN: J10.6 ; also sheet 4,6
IN_3V3_M2_ENC_PH_N [high speed]: J10.22 ; also sheet 2
OUT_3V3_GPO1_H: J10.34 ; also sheet 12
OUT_3V3_GPO2_H: J9.20 ; also sheet 12
OUT_3V3_GPO3_H: J9.18 ; also sheet 12
OUT_3V3_GPO4_H: J9.17 ; also sheet 12
OUT_3V3_GPO5_H: J9.14 ; also sheet 12
OUT_3V3_GPO6_H: J9.11 ; also sheet 12
OUT_3V3_GPO7_H: J9.10 ; also sheet 12
OUT_3V3_M1_RUN: J10.7 ; also sheet 1
OUT_3V3_M2_CCW [high speed]: J9.8 ; also sheet 5
OUT_3V3_M2_RUN: J10.18 ; also sheet 1
OUT_3V3_MZ_EN: J10.37 ; also sheet 1
Unconnected: J9.1 J9.3 J9.5 J9.6 J9.7 J9.9 J9.12 J9.13 J9.19 J9.21 J9.29 J9.30 J9.31 J9.32 J9.33 J9.35 J9.36 J9.37 J9.38 J9.39 J9.40 J9.41 J9.42 J9.43 J9.44 J9.45 J9.46 J9.47 J9.48 J9.49 J9.50 J10.1 J10.3 J10.5 J10.10 J10.11 J10.12 J10.13 J10.15 J10.16 J10.17 J10.20 J10.21 J10.24 J10.25 J10.26 J10.27 J10.28 J10.29 J10.30 J10.31 J10.33 J10.35 J10.36 J10.38 J10.40 J10.41 J10.42 J10.43 J10.44 J10.45 J10.46 J10.47 J10.48 J10.49 J10.50

## Sheet 8 of 13
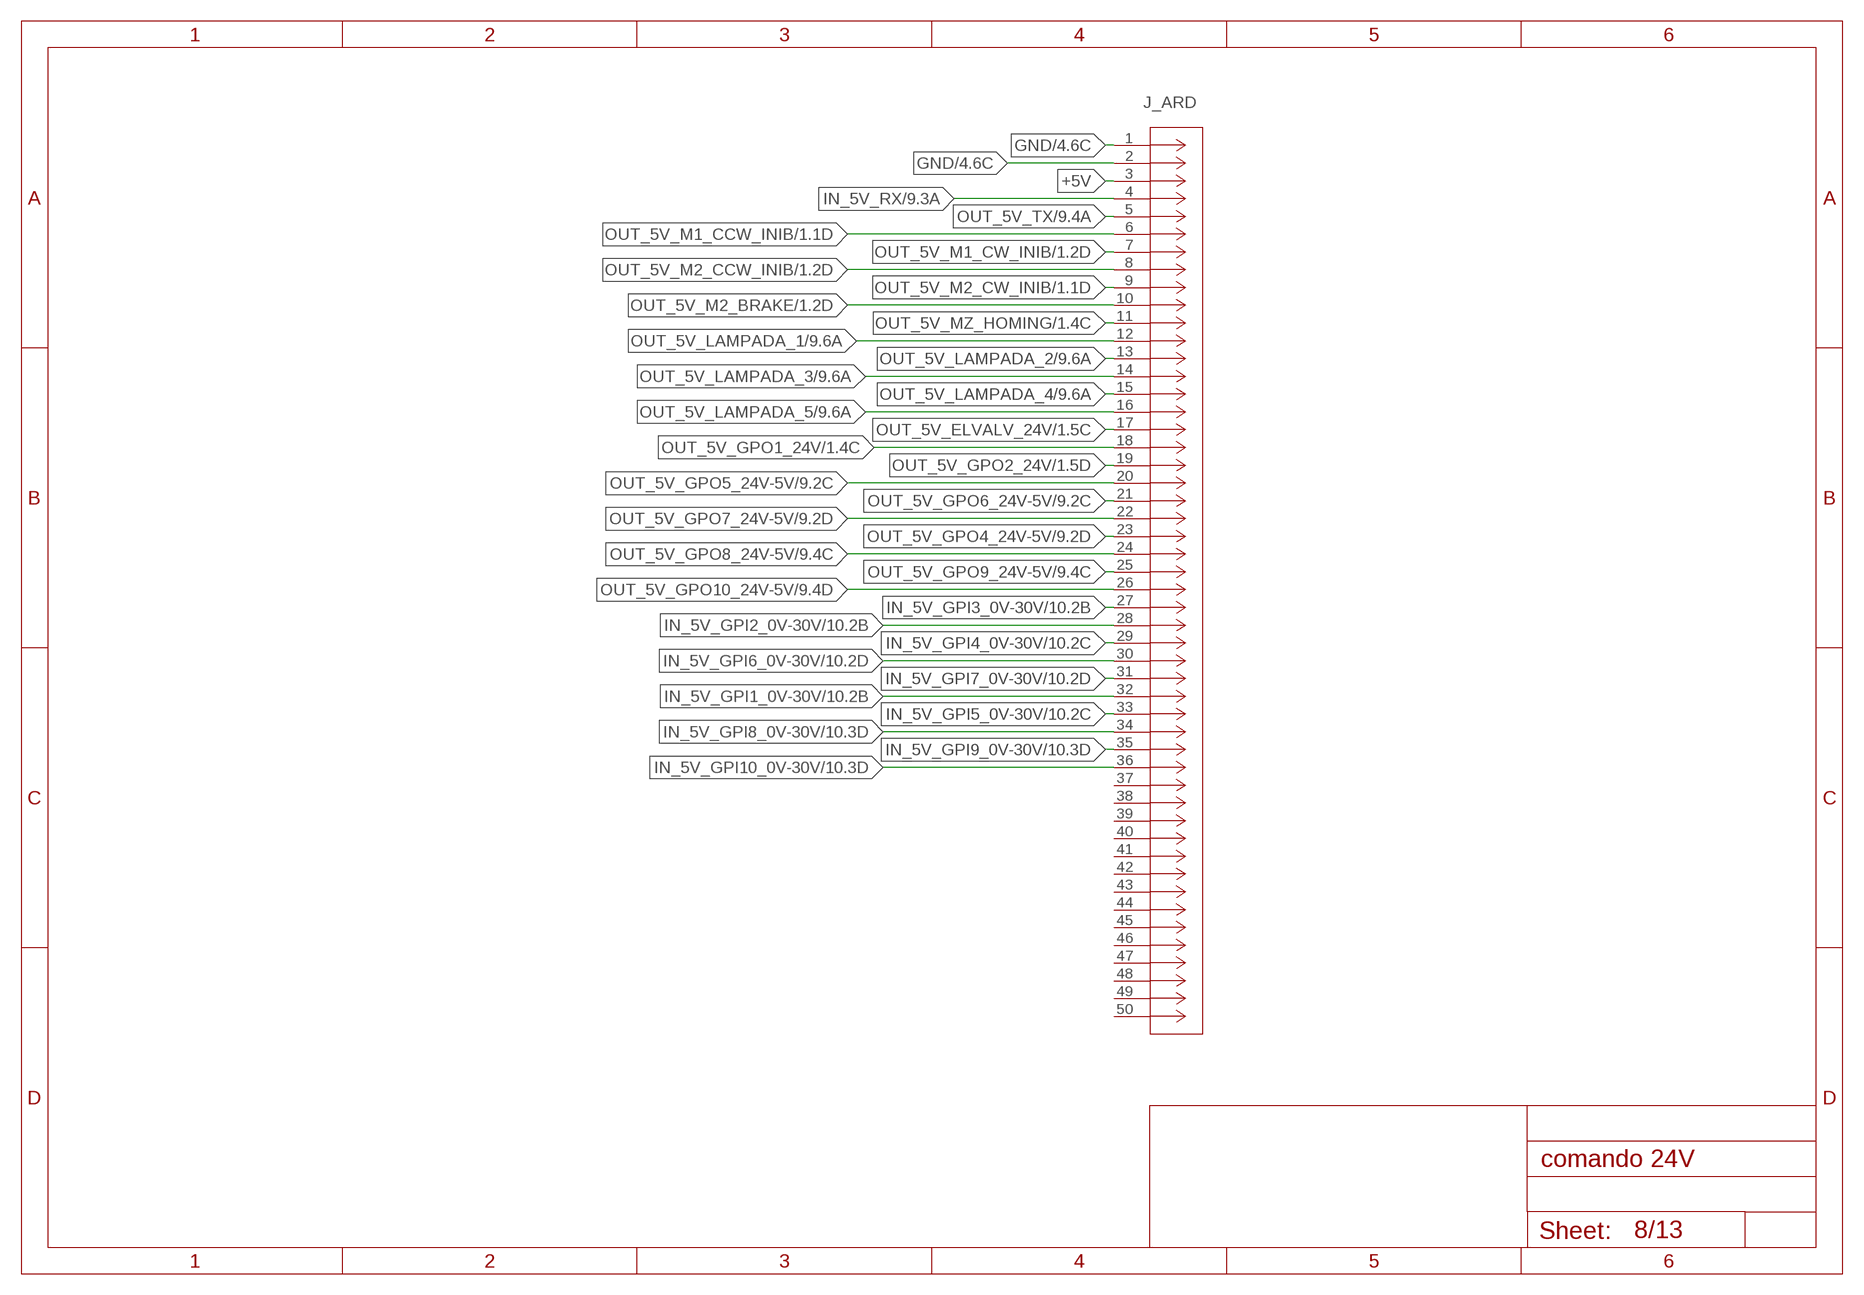
[diagram p7: schematic, sheet 8]

### Parts
J_ARD  SBH11-PBPC-D25-ST-BK  [CONN_SBH11-PBPC-D25-ST-BK_SUL]

### Nets
+5V [supply]: J_ARD.3 ; also sheet 1,2,3,5,9,10,11,12
GND [ground]: J_ARD.1 J_ARD.2 ; also sheet 1,2,3,4,5,6,7,9,10,11,12
IN_5V_GPI1_0V-30V: J_ARD.32 ; also sheet 10
IN_5V_GPI2_0V-30V: J_ARD.28 ; also sheet 10
IN_5V_GPI3_0V-30V: J_ARD.27 ; also sheet 10
IN_5V_GPI4_0V-30V: J_ARD.29 ; also sheet 10
IN_5V_GPI5_0V-30V: J_ARD.33 ; also sheet 10
IN_5V_GPI6_0V-30V: J_ARD.30 ; also sheet 10
IN_5V_GPI7_0V-30V: J_ARD.31 ; also sheet 10
IN_5V_GPI8_0V-30V: J_ARD.34 ; also sheet 10
IN_5V_GPI9_0V-30V: J_ARD.35 ; also sheet 10
IN_5V_GPI10_0V-30V: J_ARD.36 ; also sheet 10
IN_5V_RX [high speed]: J_ARD.4 ; also sheet 9
OUT_5V_ELVALV_24V: J_ARD.17 ; also sheet 1
OUT_5V_GPO1_24V: J_ARD.18 ; also sheet 1
OUT_5V_GPO2_24V: J_ARD.19 ; also sheet 1
OUT_5V_GPO4_24V-5V: J_ARD.23 ; also sheet 9
OUT_5V_GPO5_24V-5V: J_ARD.20 ; also sheet 9
OUT_5V_GPO6_24V-5V: J_ARD.21 ; also sheet 9
OUT_5V_GPO7_24V-5V: J_ARD.22 ; also sheet 9
OUT_5V_GPO8_24V-5V: J_ARD.24 ; also sheet 9
OUT_5V_GPO9_24V-5V: J_ARD.25 ; also sheet 9
OUT_5V_GPO10_24V-5V: J_ARD.26 ; also sheet 9
OUT_5V_LAMPADA_1: J_ARD.12 ; also sheet 9
OUT_5V_LAMPADA_2: J_ARD.13 ; also sheet 9
OUT_5V_LAMPADA_3: J_ARD.14 ; also sheet 9
OUT_5V_LAMPADA_4: J_ARD.15 ; also sheet 9
OUT_5V_LAMPADA_5: J_ARD.16 ; also sheet 9
OUT_5V_M1_CCW_INIB: J_ARD.6 ; also sheet 1
OUT_5V_M1_CW_INIB: J_ARD.7 ; also sheet 1
OUT_5V_M2_BRAKE: J_ARD.10 ; also sheet 1
OUT_5V_M2_CCW_INIB: J_ARD.8 ; also sheet 1
OUT_5V_M2_CW_INIB: J_ARD.9 ; also sheet 1
OUT_5V_MZ_HOMING: J_ARD.11 ; also sheet 1
OUT_5V_TX [high speed]: J_ARD.5 ; also sheet 9
Unconnected: J_ARD.37 J_ARD.38 J_ARD.39 J_ARD.40 J_ARD.41 J_ARD.42 J_ARD.43 J_ARD.44 J_ARD.45 J_ARD.46 J_ARD.47 J_ARD.48 J_ARD.49 J_ARD.50

## Sheet 9 of 13
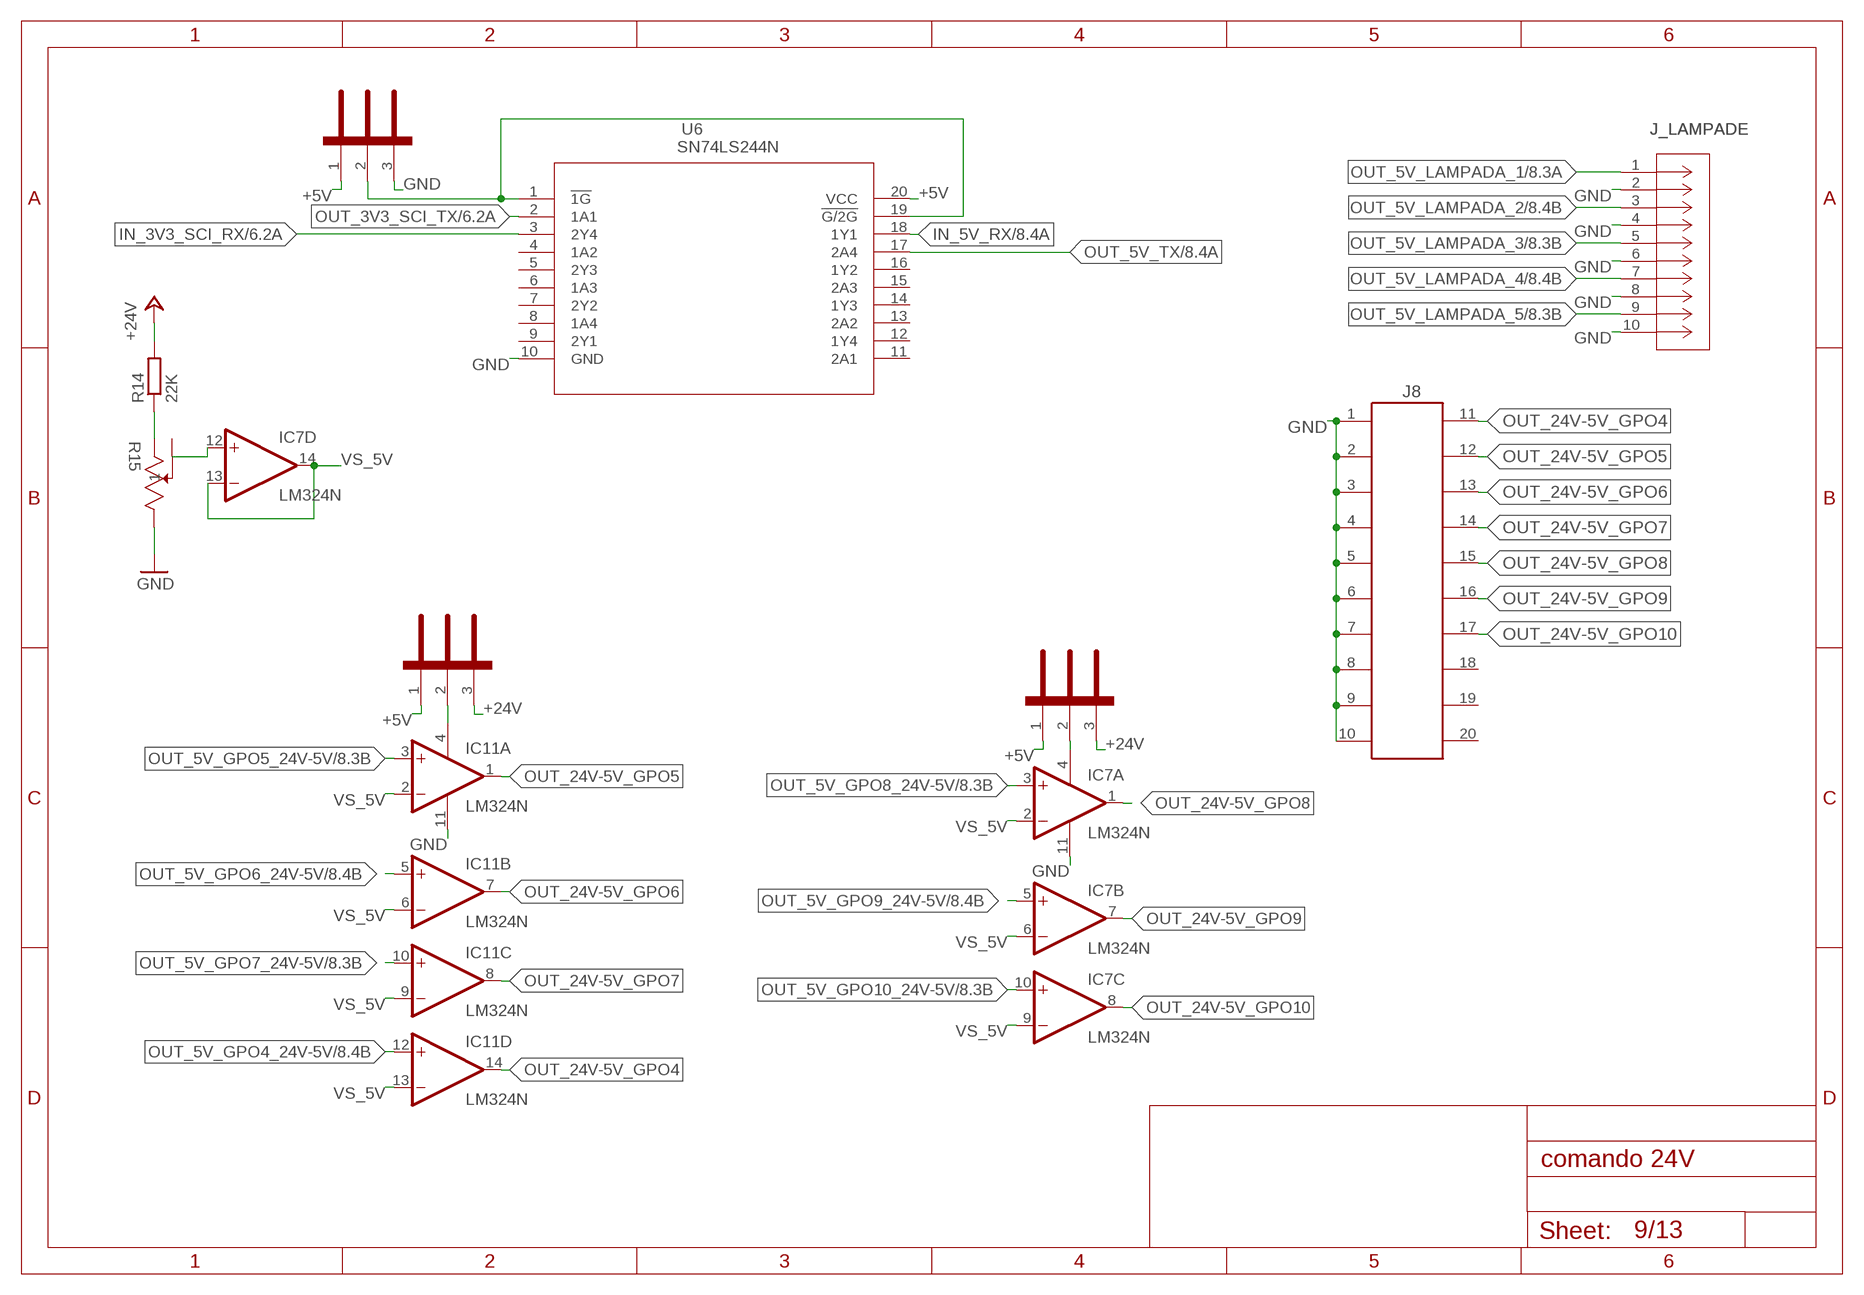
[diagram p8: schematic, sheet 9]

### Parts
EN_SCI  STRIP_3  [STRIP_3]
IC7  LM324N  [DIL14]
IC11  LM324N  [DIL14]
J8  61202021621  [61202021621]
J_LAMPADE  61201021621  [CONN_61201021621_WRE]
OUT_ARD_4-7_5V-24V  STRIP_3  [STRIP_3]
OUT_ARD_8-11_5V-24V  STRIP_3  [STRIP_3]
R14  22K  R-EU_207/100207/10  [0207/10]
R15  VS_5v_ADJ  64WR5KLF  [RES3_64W_TTE]
U6  SN74LS244N  [N20]

### Nets
+5V [supply]: EN_SCI.1 OUT_ARD_4-7_5V-24V.1 OUT_ARD_8-11_5V-24V.1 U6.20(VCC) ; also sheet 1,2,3,5,8,10,11,12
+24V [supply]: OUT_ARD_4-7_5V-24V.3 OUT_ARD_8-11_5V-24V.3 R14.2 ; also sheet 1,2,3,4,5,10,11
GND [ground]: EN_SCI.3 IC7.11(P:V-) IC11.11(P:V-) J8.1 J8.2 J8.3 J8.4 J8.5 J8.6 J8.7 J8.8 J8.9 J8.10 J_LAMPADE.2 J_LAMPADE.4 J_LAMPADE.6 J_LAMPADE.8 J_LAMPADE.10 R15.3 U6.10(GND) ; also sheet 1,2,3,4,5,6,7,8,10,11,12
IN_3V3_SCI_RX [high speed]: U6.3(2Y4) ; also sheet 6
IN_5V_RX [high speed]: U6.18(1Y1) ; also sheet 8
N$18: EN_SCI.2 U6.1(!1G) U6.19(!G/2G)
N$20: R14.1 R15.1
N$22: IC11.4(P:V+) OUT_ARD_4-7_5V-24V.2
N$26: IC7.4(P:V+) OUT_ARD_8-11_5V-24V.2
N$27: IC7.12(D:+IN) R15.2
OUT_3V3_SCI_TX [high speed]: U6.2(1A1) ; also sheet 6
OUT_5V_GPO4_24V-5V: IC11.12(D:+IN) ; also sheet 8
OUT_5V_GPO5_24V-5V: IC11.3(A:+IN) ; also sheet 8
OUT_5V_GPO6_24V-5V: IC11.5(B:+IN) ; also sheet 8
OUT_5V_GPO7_24V-5V: IC11.10(C:+IN) ; also sheet 8
OUT_5V_GPO8_24V-5V: IC7.3(A:+IN) ; also sheet 8
OUT_5V_GPO9_24V-5V: IC7.5(B:+IN) ; also sheet 8
OUT_5V_GPO10_24V-5V: IC7.10(C:+IN) ; also sheet 8
OUT_5V_LAMPADA_1: J_LAMPADE.1 ; also sheet 8
OUT_5V_LAMPADA_2: J_LAMPADE.3 ; also sheet 8
OUT_5V_LAMPADA_3: J_LAMPADE.5 ; also sheet 8
OUT_5V_LAMPADA_4: J_LAMPADE.7 ; also sheet 8
OUT_5V_LAMPADA_5: J_LAMPADE.9 ; also sheet 8
OUT_5V_TX [high speed]: U6.17(2A4) ; also sheet 8
OUT_24V-5V_GPO4: IC11.14(D:OUT) J8.11
OUT_24V-5V_GPO5: IC11.1(A:OUT) J8.12
OUT_24V-5V_GPO6: IC11.7(B:OUT) J8.13
OUT_24V-5V_GPO7: IC11.8(C:OUT) J8.14
OUT_24V-5V_GPO8: IC7.1(A:OUT) J8.15
OUT_24V-5V_GPO9: IC7.7(B:OUT) J8.16
OUT_24V-5V_GPO10: IC7.8(C:OUT) J8.17
VS_5V: IC7.2(A:-IN) IC7.6(B:-IN) IC7.9(C:-IN) IC7.13(D:-IN) IC7.14(D:OUT) IC11.2(A:-IN) IC11.6(B:-IN) IC11.9(C:-IN) IC11.13(D:-IN)
Unconnected: J8.18 J8.19 J8.20 U6.4(1A2) U6.5(2Y3) U6.6(1A3) U6.7(2Y2) U6.8(1A4) U6.9(2Y1) U6.11(2A1) U6.12(1Y4) U6.13(2A2) U6.14(1Y3) U6.15(2A3) U6.16(1Y2)

## Sheet 10 of 13
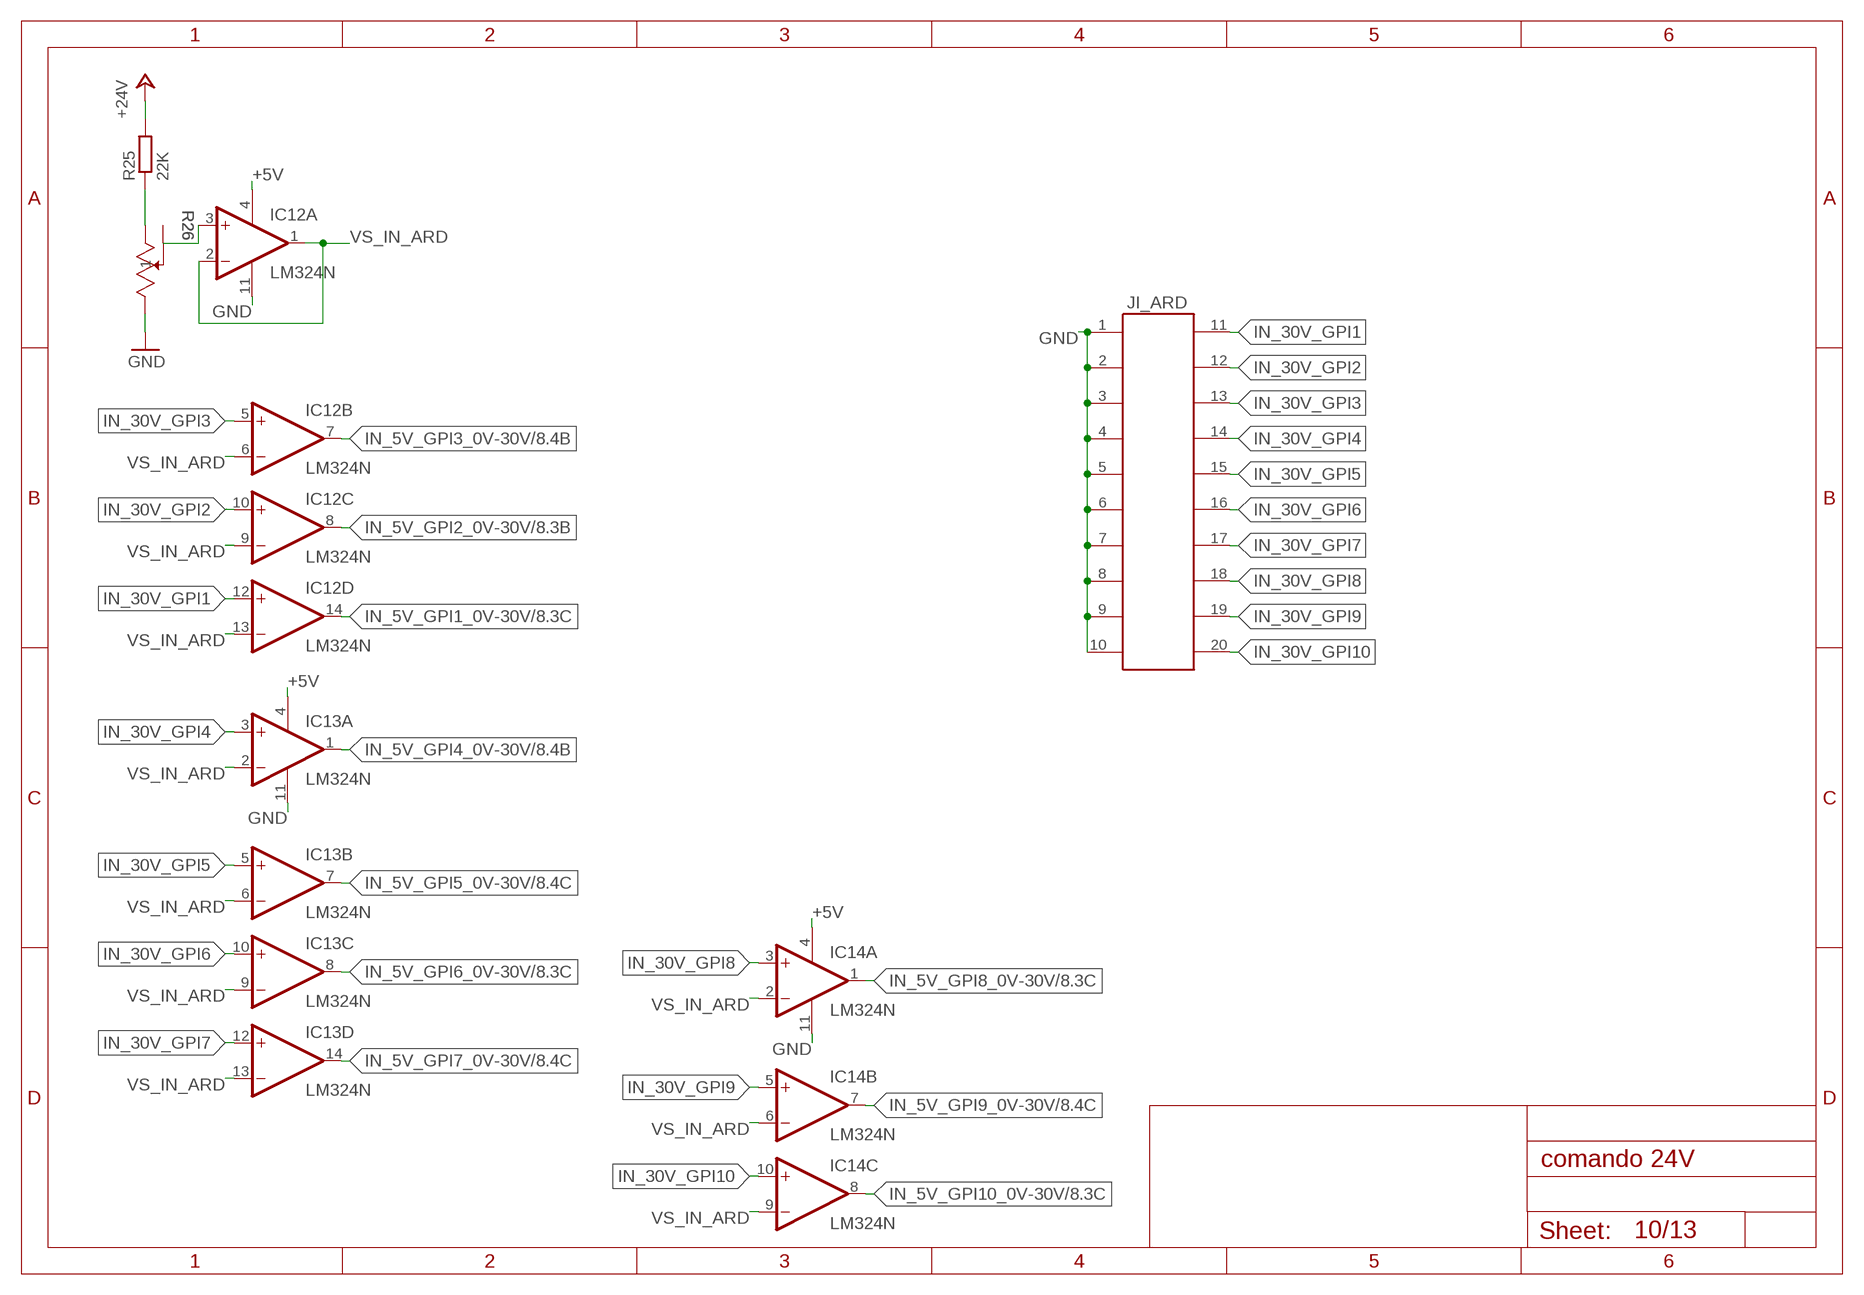
[diagram p9: schematic, sheet 10]

### Parts
IC12  LM324N  [DIL14]
IC13  LM324N  [DIL14]
IC14  LM324N  [DIL14]
JI_ARD  61202021621  [61202021621]
R25  22K  R-EU_207/100207/10  [0207/10]
R26  VS_ARD_ADJ  64WR5KLF  [RES3_64W_TTE]

### Nets
+5V [supply]: IC12.4(P:V+) IC13.4(P:V+) IC14.4(P:V+) ; also sheet 1,2,3,5,8,9,11,12
+24V [supply]: R25.2 ; also sheet 1,2,3,4,5,9,11
GND [ground]: IC12.11(P:V-) IC13.11(P:V-) IC14.11(P:V-) JI_ARD.1 JI_ARD.2 JI_ARD.3 JI_ARD.4 JI_ARD.5 JI_ARD.6 JI_ARD.7 JI_ARD.8 JI_ARD.9 JI_ARD.10 R26.3 ; also sheet 1,2,3,4,5,6,7,8,9,11,12
IN_5V_GPI1_0V-30V: IC12.14(D:OUT) ; also sheet 8
IN_5V_GPI2_0V-30V: IC12.8(C:OUT) ; also sheet 8
IN_5V_GPI3_0V-30V: IC12.7(B:OUT) ; also sheet 8
IN_5V_GPI4_0V-30V: IC13.1(A:OUT) ; also sheet 8
IN_5V_GPI5_0V-30V: IC13.7(B:OUT) ; also sheet 8
IN_5V_GPI6_0V-30V: IC13.8(C:OUT) ; also sheet 8
IN_5V_GPI7_0V-30V: IC13.14(D:OUT) ; also sheet 8
IN_5V_GPI8_0V-30V: IC14.1(A:OUT) ; also sheet 8
IN_5V_GPI9_0V-30V: IC14.7(B:OUT) ; also sheet 8
IN_5V_GPI10_0V-30V: IC14.8(C:OUT) ; also sheet 8
IN_30V_GPI1: IC12.12(D:+IN) JI_ARD.11
IN_30V_GPI2: IC12.10(C:+IN) JI_ARD.12
IN_30V_GPI3: IC12.5(B:+IN) JI_ARD.13
IN_30V_GPI4: IC13.3(A:+IN) JI_ARD.14
IN_30V_GPI5: IC13.5(B:+IN) JI_ARD.15
IN_30V_GPI6: IC13.10(C:+IN) JI_ARD.16
IN_30V_GPI7: IC13.12(D:+IN) JI_ARD.17
IN_30V_GPI8: IC14.3(A:+IN) JI_ARD.18
IN_30V_GPI9: IC14.5(B:+IN) JI_ARD.19
IN_30V_GPI10: IC14.10(C:+IN) JI_ARD.20
N$15: R25.1 R26.1
N$25: IC12.3(A:+IN) R26.2
VS_IN_ARD: IC12.1(A:OUT) IC12.2(A:-IN) IC12.6(B:-IN) IC12.9(C:-IN) IC12.13(D:-IN) IC13.2(A:-IN) IC13.6(B:-IN) IC13.9(C:-IN) IC13.13(D:-IN) IC14.2(A:-IN) IC14.6(B:-IN) IC14.9(C:-IN)
Unconnected: IC14.12(D:+IN) IC14.13(D:-IN) IC14.14(D:OUT)

## Sheet 11 of 13
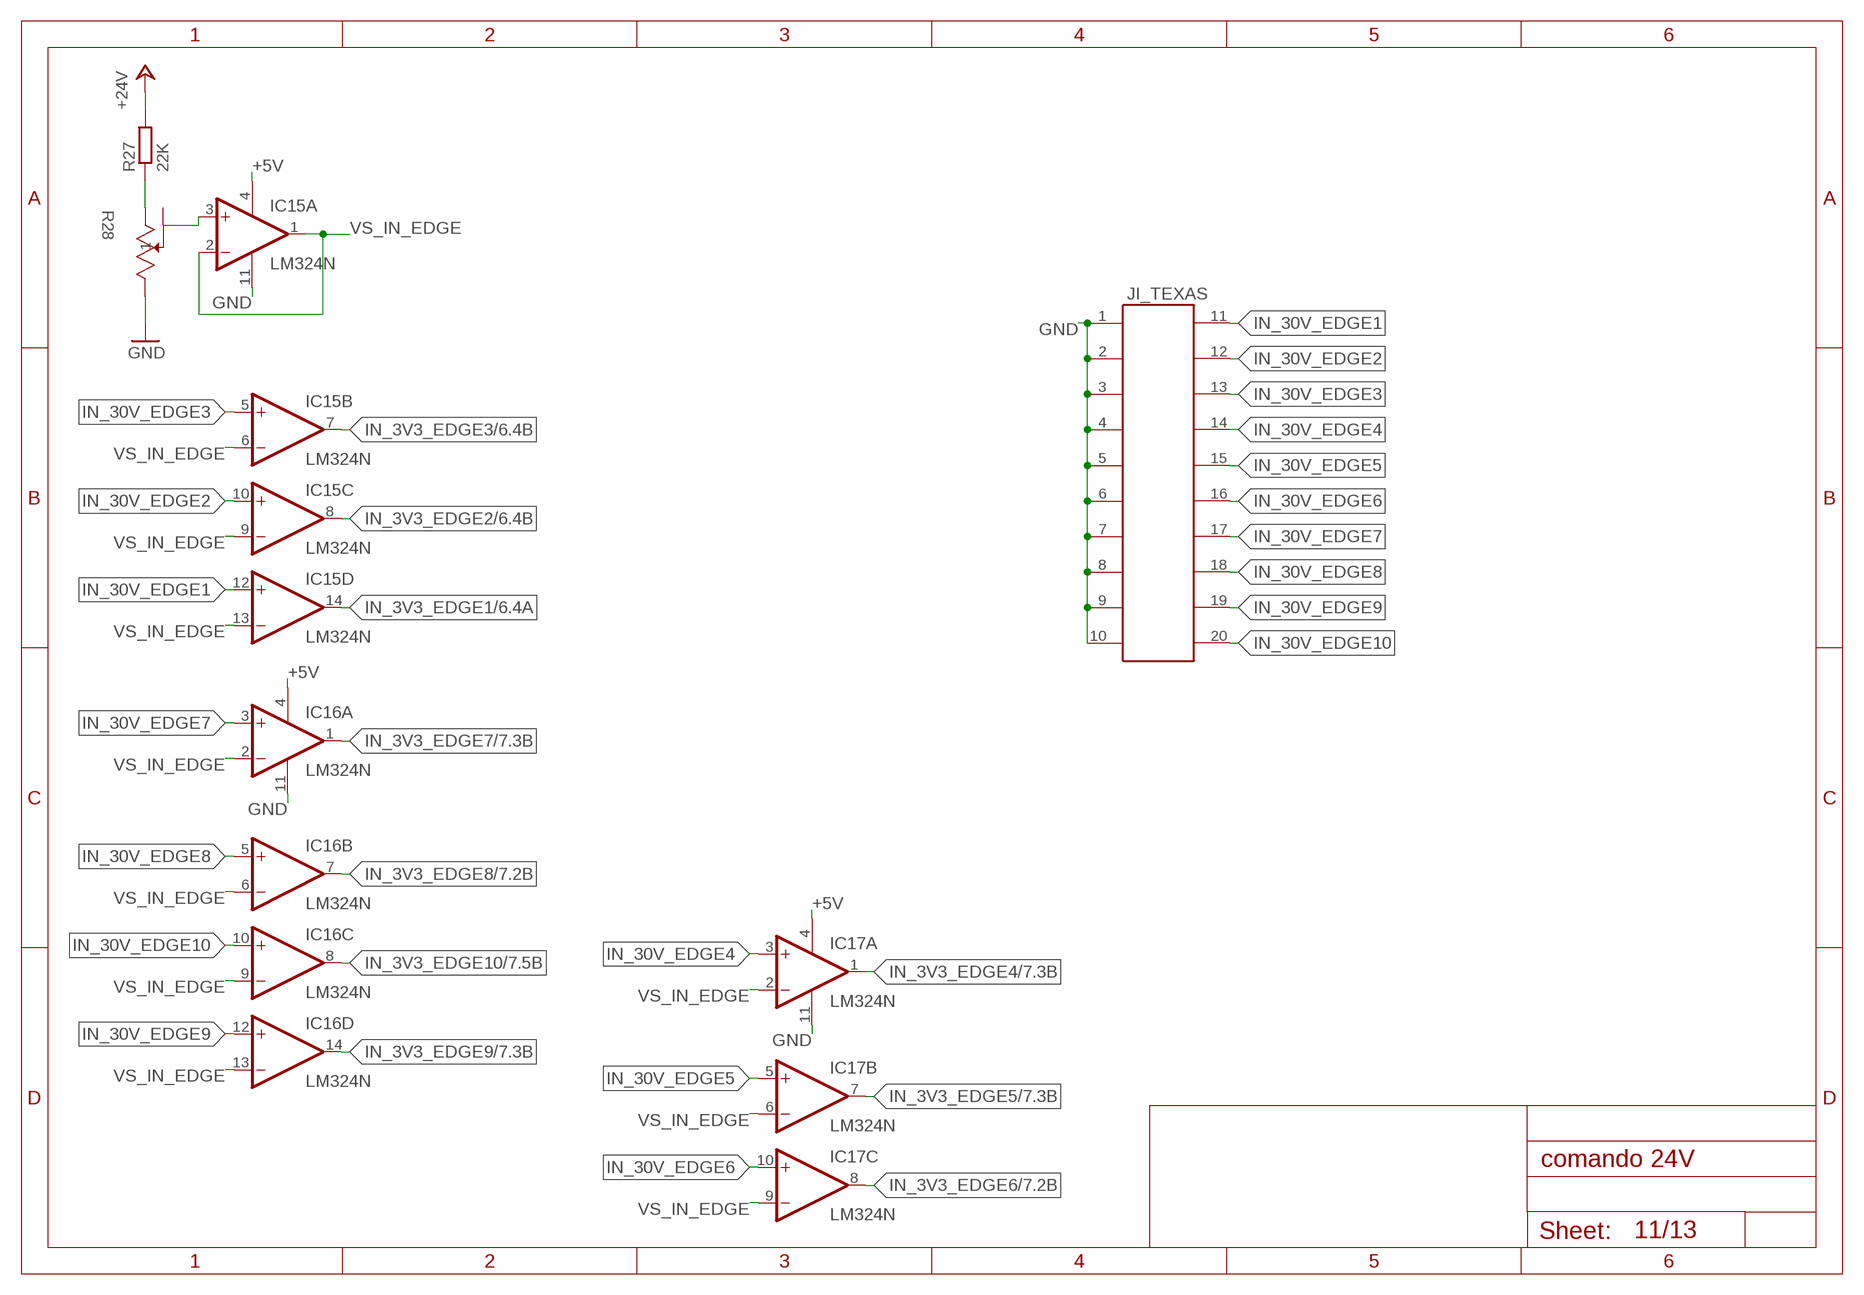
[diagram p10: schematic, sheet 11]

### Parts
IC15  LM324N  [DIL14]
IC16  LM324N  [DIL14]
JI_TEXAS  61202021621  [61202021621]
R27  22K  R-EU_207/100207/10  [0207/10]
R28  VS_EDGE_ADJ  64WR5KLF  [RES3_64W_TTE]

### Nets
+5V [supply]: IC15.4(P:V+) IC16.4(P:V+) IC17.4(P:V+) ; also sheet 1,2,3,5,8,9,10,12
+24V [supply]: R27.2 ; also sheet 1,2,3,4,5,9,10
GND [ground]: IC15.11(P:V-) IC16.11(P:V-) IC17.11(P:V-) JI_TEXAS.1 JI_TEXAS.2 JI_TEXAS.3 JI_TEXAS.4 JI_TEXAS.5 JI_TEXAS.6 JI_TEXAS.7 JI_TEXAS.8 JI_TEXAS.9 JI_TEXAS.10 R28.3 ; also sheet 1,2,3,4,5,6,7,8,9,10,12
IN_3V3_EDGE1: IC15.14(D:OUT) ; also sheet 6
IN_3V3_EDGE2: IC15.8(C:OUT) ; also sheet 6
IN_3V3_EDGE3: IC15.7(B:OUT) ; also sheet 6
IN_3V3_EDGE4: IC17.1(A:OUT) ; also sheet 7
IN_3V3_EDGE5: IC17.7(B:OUT) ; also sheet 7
IN_3V3_EDGE6: IC17.8(C:OUT) ; also sheet 7
IN_3V3_EDGE7: IC16.1(A:OUT) ; also sheet 7
IN_3V3_EDGE8: IC16.7(B:OUT) ; also sheet 7
IN_3V3_EDGE9: IC16.14(D:OUT) ; also sheet 7
IN_3V3_EDGE10: IC16.8(C:OUT) ; also sheet 7
IN_30V_EDGE1 [mid speed]: IC15.12(D:+IN) JI_TEXAS.11
IN_30V_EDGE2 [mid speed]: IC15.10(C:+IN) JI_TEXAS.12
IN_30V_EDGE3 [mid speed]: IC15.5(B:+IN) JI_TEXAS.13
IN_30V_EDGE4 [mid speed]: IC17.3(A:+IN) JI_TEXAS.14
IN_30V_EDGE5 [mid speed]: IC17.5(B:+IN) JI_TEXAS.15
IN_30V_EDGE6 [mid speed]: IC17.10(C:+IN) JI_TEXAS.16
IN_30V_EDGE7 [mid speed]: IC16.3(A:+IN) JI_TEXAS.17
IN_30V_EDGE8 [mid speed]: IC16.5(B:+IN) JI_TEXAS.18
IN_30V_EDGE9 [mid speed]: IC16.12(D:+IN) JI_TEXAS.19
IN_30V_EDGE10 [mid speed]: IC16.10(C:+IN) JI_TEXAS.20
N$17: R27.1 R28.1
N$33: IC15.3(A:+IN) R28.2
VS_IN_EDGE: IC15.1(A:OUT) IC15.2(A:-IN) IC15.6(B:-IN) IC15.9(C:-IN) IC15.13(D:-IN) IC16.2(A:-IN) IC16.6(B:-IN) IC16.9(C:-IN) IC16.13(D:-IN) IC17.2(A:-IN) IC17.6(B:-IN) IC17.9(C:-IN)

## Sheet 12 of 13
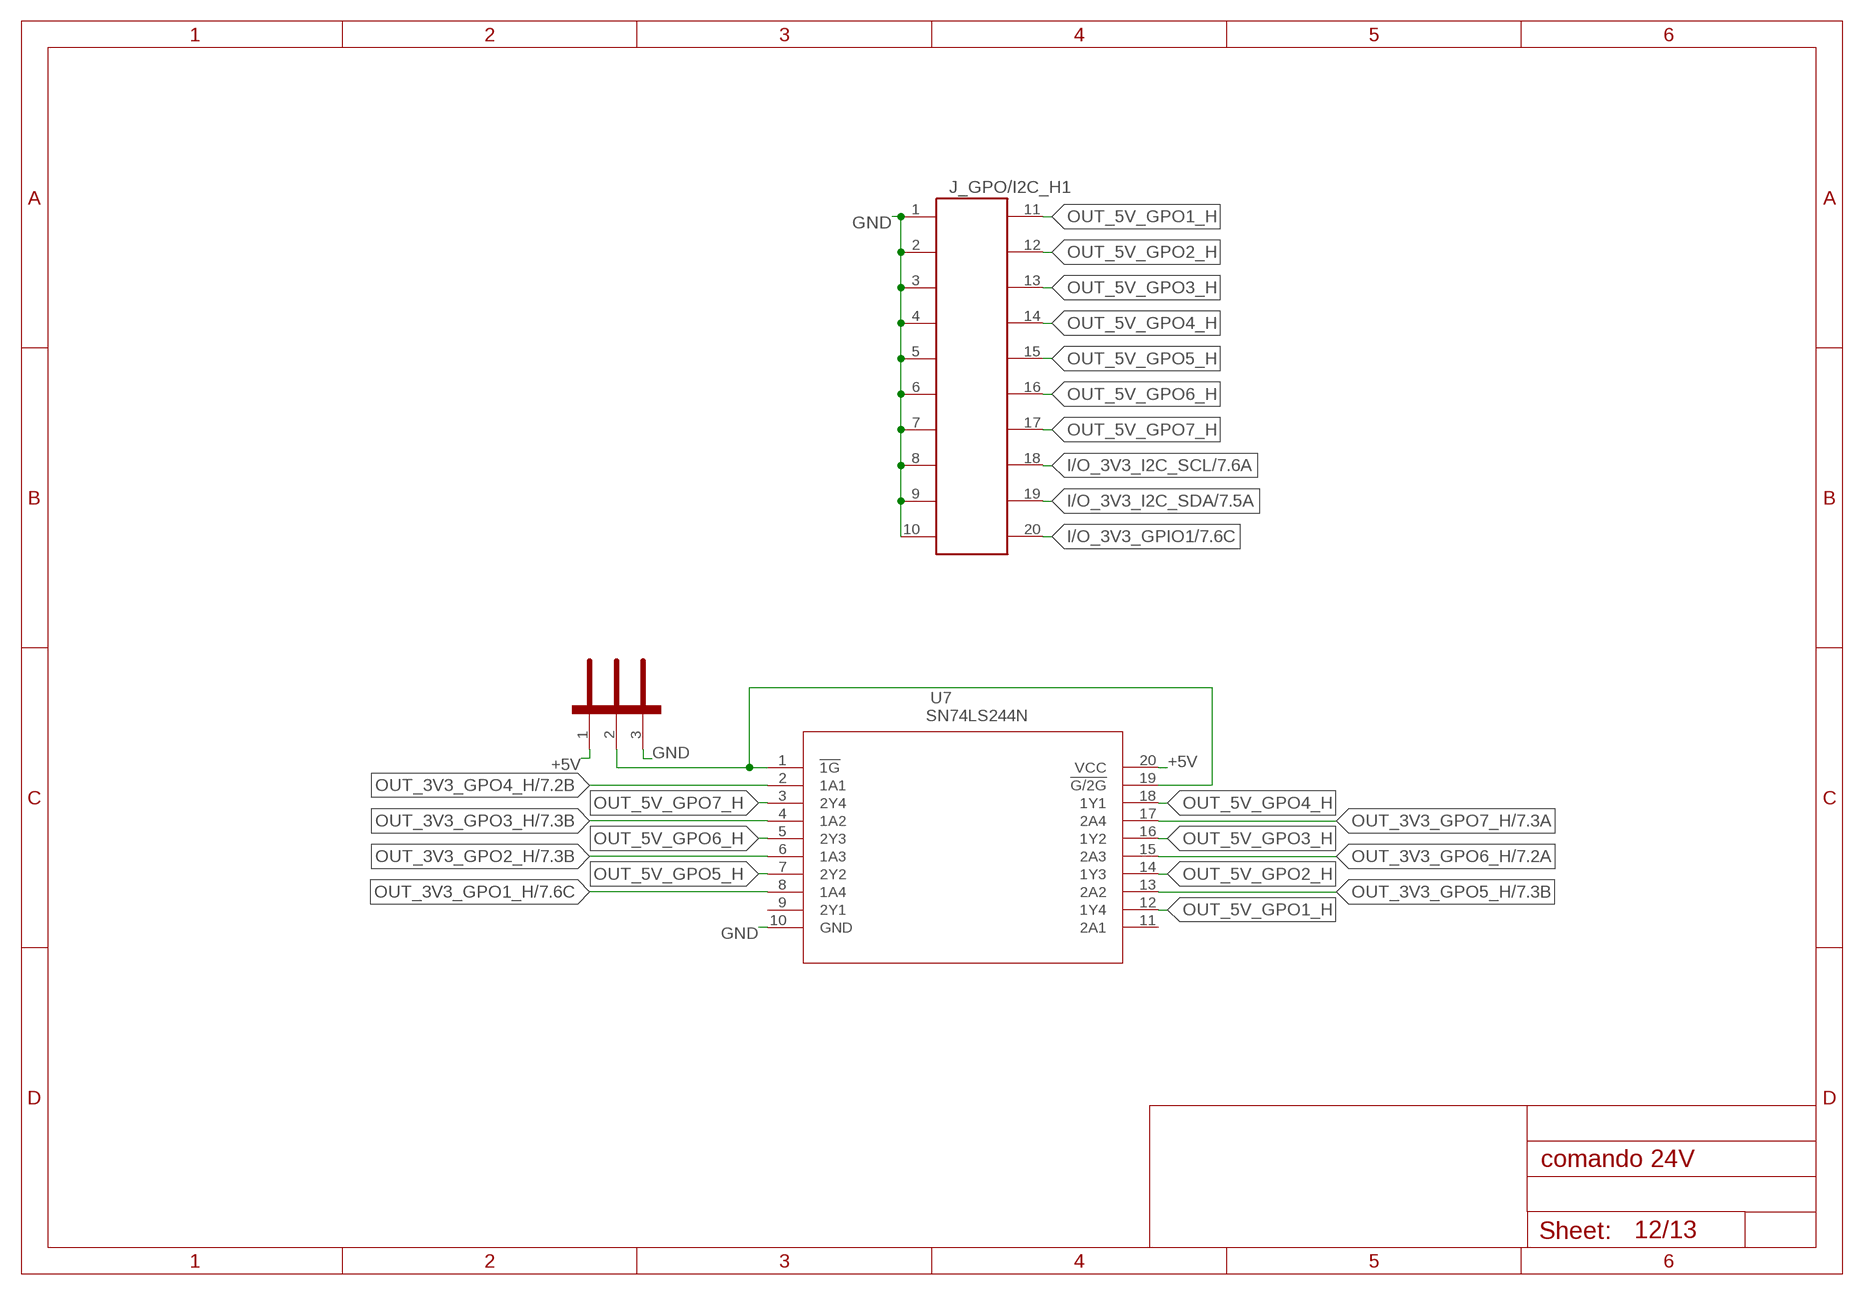
[diagram p11: schematic, sheet 12]

### Parts
EN_GPO_H  STRIP_3  [STRIP_3]
J_GPO/I2C_H1  61202021621  [61202021621]
U7  SN74LS244N  [N20]

### Nets
+5V [supply]: EN_GPO_H.1 U7.20(VCC) ; also sheet 1,2,3,5,8,9,10,11
GND [ground]: EN_GPO_H.3 J_GPO/I2C_H1.1 J_GPO/I2C_H1.2 J_GPO/I2C_H1.3 J_GPO/I2C_H1.4 J_GPO/I2C_H1.5 J_GPO/I2C_H1.6 J_GPO/I2C_H1.7 J_GPO/I2C_H1.8 J_GPO/I2C_H1.9 J_GPO/I2C_H1.10 U7.10(GND) ; also sheet 1,2,3,4,5,6,7,8,9,10,11
I/O_3V3_GPIO1: J_GPO/I2C_H1.20 ; also sheet 7
I/O_3V3_I2C_SCL [high speed]: J_GPO/I2C_H1.18 ; also sheet 7
I/O_3V3_I2C_SDA [high speed]: J_GPO/I2C_H1.19 ; also sheet 7
N$19: EN_GPO_H.2 U7.1(!1G) U7.19(!G/2G)
OUT_3V3_GPO1_H: U7.8(1A4) ; also sheet 7
OUT_3V3_GPO2_H: U7.6(1A3) ; also sheet 7
OUT_3V3_GPO3_H: U7.4(1A2) ; also sheet 7
OUT_3V3_GPO4_H: U7.2(1A1) ; also sheet 7
OUT_3V3_GPO5_H: U7.13(2A2) ; also sheet 7
OUT_3V3_GPO6_H: U7.15(2A3) ; also sheet 7
OUT_3V3_GPO7_H: U7.17(2A4) ; also sheet 7
OUT_5V_GPO1_H [mid speed]: J_GPO/I2C_H1.11 U7.12(1Y4)
OUT_5V_GPO2_H [mid speed]: J_GPO/I2C_H1.12 U7.14(1Y3)
OUT_5V_GPO3_H [mid speed]: J_GPO/I2C_H1.13 U7.16(1Y2)
OUT_5V_GPO4_H [mid speed]: J_GPO/I2C_H1.14 U7.18(1Y1)
OUT_5V_GPO5_H [mid speed]: J_GPO/I2C_H1.15 U7.7(2Y2)
OUT_5V_GPO6_H [mid speed]: J_GPO/I2C_H1.16 U7.5(2Y3)
OUT_5V_GPO7_H [mid speed]: J_GPO/I2C_H1.17 U7.3(2Y4)
Unconnected: U7.9(2Y1) U7.11(2A1)

## Sheet 13 of 13
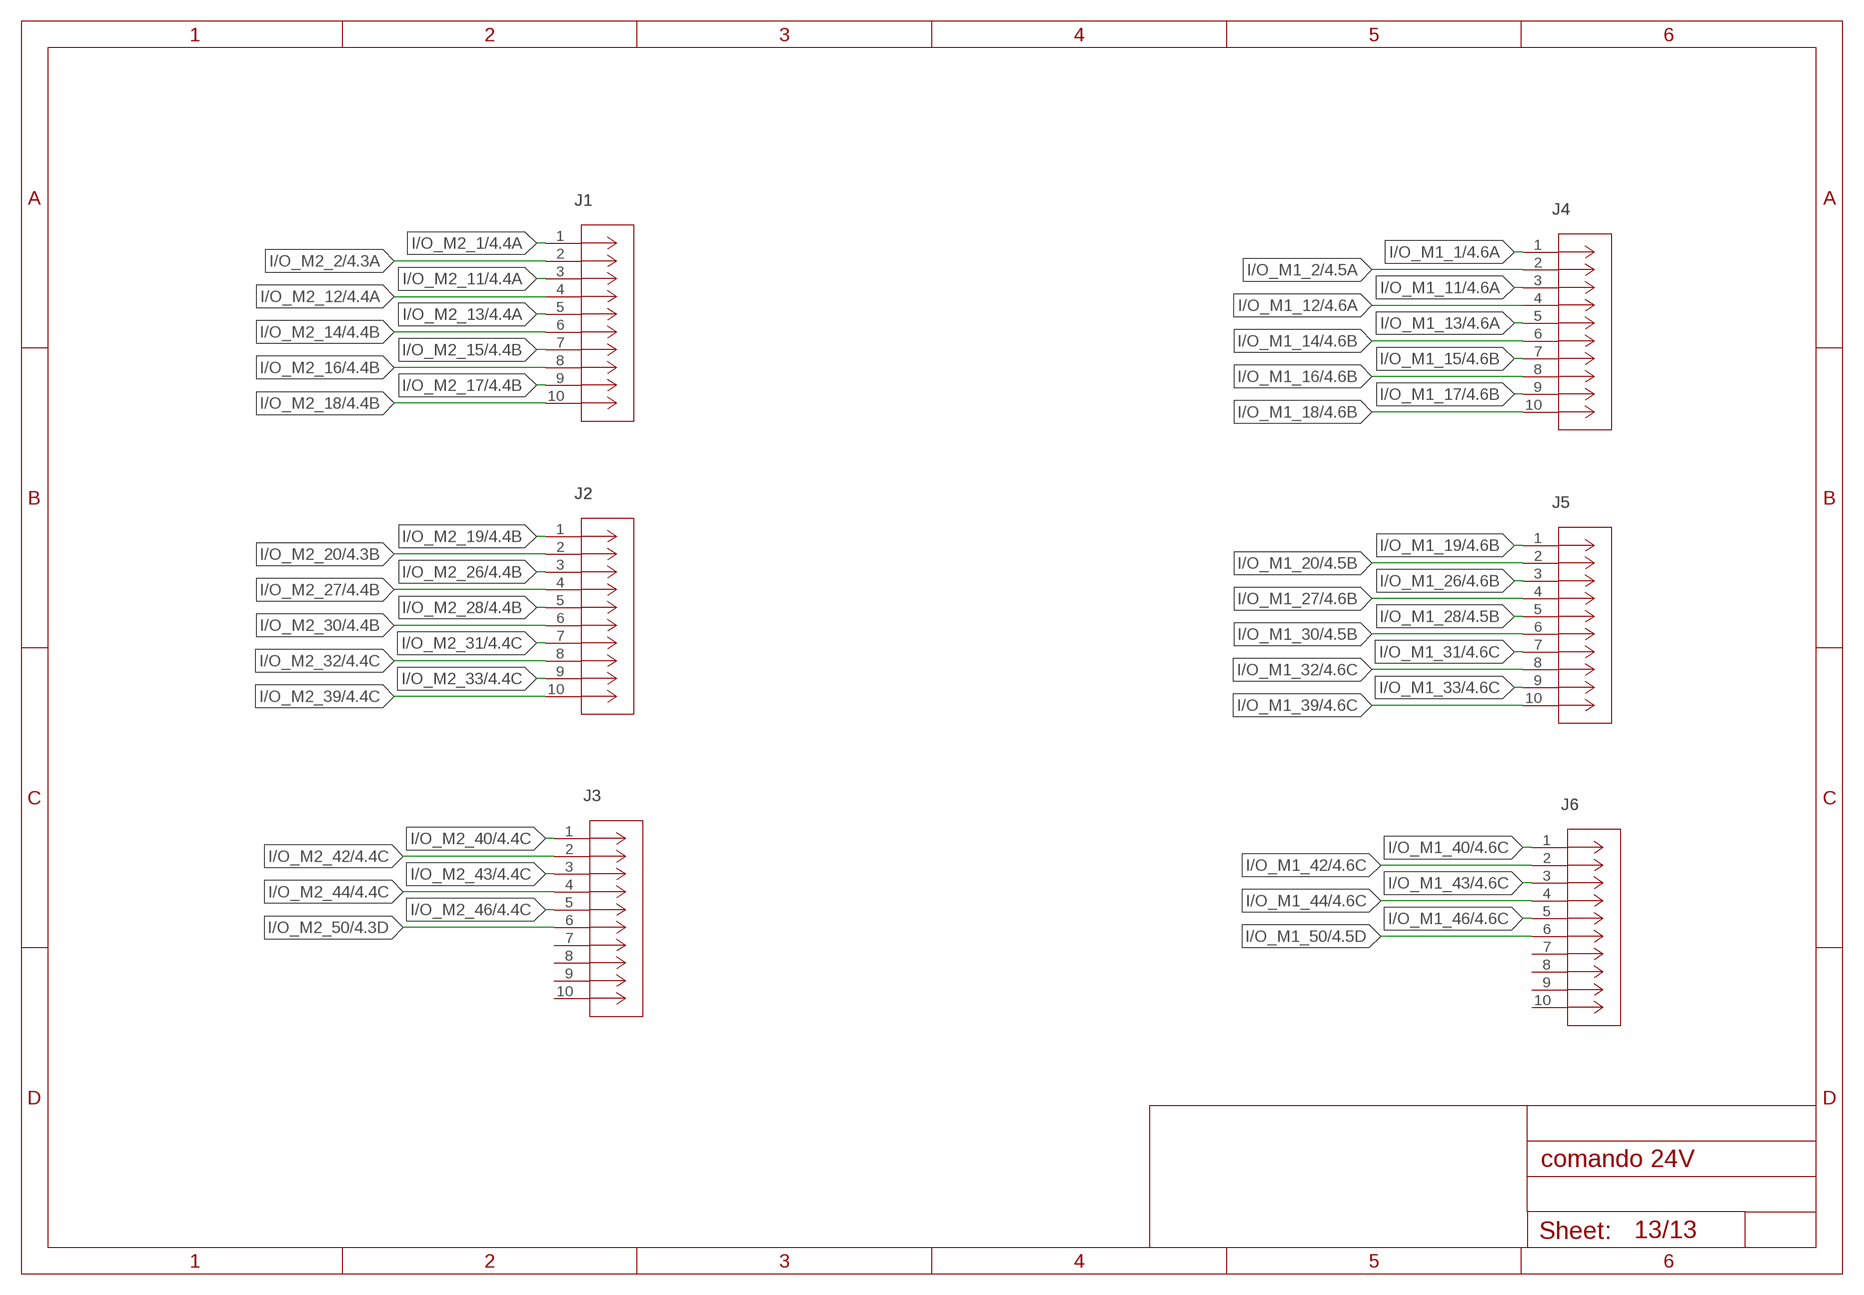
[diagram p12: schematic, sheet 13]

### Parts
J1  61201021621  [CONN_61201021621_WRE]
J2  61201021621  [CONN_61201021621_WRE]
J3  61201021621  [CONN_61201021621_WRE]
J4  61201021621  [CONN_61201021621_WRE]
J5  61201021621  [CONN_61201021621_WRE]
J6  61201021621  [CONN_61201021621_WRE]

### Nets
I/O_M1_1: J4.1 ; also sheet 4
I/O_M1_2: J4.2 ; also sheet 4
I/O_M1_11: J4.3 ; also sheet 4
I/O_M1_12: J4.4 ; also sheet 4
I/O_M1_13: J4.5 ; also sheet 4
I/O_M1_14: J4.6 ; also sheet 4
I/O_M1_15: J4.7 ; also sheet 4
I/O_M1_16: J4.8 ; also sheet 4
I/O_M1_17: J4.9 ; also sheet 4
I/O_M1_18: J4.10 ; also sheet 4
I/O_M1_19: J5.1 ; also sheet 4
I/O_M1_20: J5.2 ; also sheet 4
I/O_M1_26: J5.3 ; also sheet 4
I/O_M1_27: J5.4 ; also sheet 4
I/O_M1_28: J5.5 ; also sheet 4
I/O_M1_30: J5.6 ; also sheet 4
I/O_M1_31: J5.7 ; also sheet 4
I/O_M1_32: J5.8 ; also sheet 4
I/O_M1_33: J5.9 ; also sheet 4
I/O_M1_39: J5.10 ; also sheet 4
I/O_M1_40: J6.1 ; also sheet 4
I/O_M1_42: J6.2 ; also sheet 4
I/O_M1_43: J6.3 ; also sheet 4
I/O_M1_44: J6.4 ; also sheet 4
I/O_M1_46: J6.5 ; also sheet 4
I/O_M1_50: J6.6 ; also sheet 4
I/O_M2_1: J1.1 ; also sheet 4
I/O_M2_2: J1.2 ; also sheet 4
I/O_M2_11: J1.3 ; also sheet 4
I/O_M2_12: J1.4 ; also sheet 4
I/O_M2_13: J1.5 ; also sheet 4
I/O_M2_14: J1.6 ; also sheet 4
I/O_M2_15: J1.7 ; also sheet 4
I/O_M2_16: J1.8 ; also sheet 4
I/O_M2_17: J1.9 ; also sheet 4
I/O_M2_18: J1.10 ; also sheet 4
I/O_M2_19: J2.1 ; also sheet 4
I/O_M2_20: J2.2 ; also sheet 4
I/O_M2_26: J2.3 ; also sheet 4
I/O_M2_27: J2.4 ; also sheet 4
I/O_M2_28: J2.5 ; also sheet 4
I/O_M2_30: J2.6 ; also sheet 4
I/O_M2_31: J2.7 ; also sheet 4
I/O_M2_32: J2.8 ; also sheet 4
I/O_M2_33: J2.9 ; also sheet 4
I/O_M2_39: J2.10 ; also sheet 4
I/O_M2_40: J3.1 ; also sheet 4
I/O_M2_42: J3.2 ; also sheet 4
I/O_M2_43: J3.3 ; also sheet 4
I/O_M2_44: J3.4 ; also sheet 4
I/O_M2_46: J3.5 ; also sheet 4
I/O_M2_50: J3.6 ; also sheet 4
Unconnected: J3.7 J3.8 J3.9 J3.10 J6.7 J6.8 J6.9 J6.10

## Library data of the parts
24V_SUP BRAKE EL_VALV EMRG_CHN = SCARA:CON_2F
AC_SUP = SCARA:B2B-XH-A(LF)(SN); BUILT_BY: EMA_Cory; COPYRIGHT: Copyright (C) 2018 Accelerated Designs. All rights reserved; MANUFACTURER_PART_NUMBER: B2B-XH-A(LF)(SN); SOURCELIBRARY: JST_2019-12-02; VENDOR: JST
C2 = SCARA:QYX1H102JTP3TA; BUILT_BY: EMA_Cory; COPYRIGHT: Copyright (C) 2018 Accelerated Designs. All rights reserved; MANUFACTURER_PART_NUMBER: QYX1H102JTP3TA; SOURCELIBRARY: Nichicon_2019-09-13; VENDOR: Nichicon
C3 = SCARA:UBY2A301MHL; BUILT_BY: EMA_Cory; COPYRIGHT: Copyright (C) 2018 Accelerated Designs. All rights reserved; MANUFACTURER_PART_NUMBER: UBY2A301MHL; SOURCELIBRARY: Nichicon_2019-09-13; VENDOR: Nichicon
EN_GPO_H EN_IN_ENC EN_OUT_MOT EN_SCI OUT_ARD_4-7_5V-24V OUT_ARD_8-11_5V-24V = SCARA:STRIP_3
EN_M1_ENC_PHZ EN_M2_ENC_PHZ = SCARA:STRIP_2
IC1 IC5 IC7 IC11-IC17 = SCARA:LM324: OP AMP
J1-J7 J_LAMPADE MOTZ = SCARA:61201021621; BUILT_BY: EMA_Justin; COPYRIGHT: Copyright (C) 2018 Accelerated Designs. All rights reserved; MANUFACTURER_PART_NUMBER: 61201021621; SOURCELIBRARY: WURTH_2019-10-22; VENDOR: Wurth Electronics
J1/J3 J4/J2 J5/J7 J8 J8/J6 J_GPO/I2C_H1 JI_ARD JI_TEXAS = SCARA:61202021621: WR-BHD 2.54mm Male Box Header, 20 Pins=>Code : Con_WTB_BHD_2.54_Male_THT_WS_61202021621 <http://katalog.we-online.de/media/thumbs2/eican/thb_Con_WTB_BHD_2.54_Male_THT_WS_6120xx21621_pf2.jpg> Details see: http://katalog.we-online.de/en/em/612_0xx_216_21 Created 2014-06-04, Karrer Zheng 2014 (C) Würth Elektronik; DESCRIPTION: Connector Header Through Hole 20 position 0.100 (2.54mm); DIGI-KEY_PART_NUMBER: 732-2096-ND; MF: Würth Elektronik; MP: 61202021621; PACKAGE: None; PURCHASE-URL: https://pricing.snapeda.com/search/part/61202021621/?ref=eda
J9 J10 J_ARD MOT1 MOT2 = SCARA:SBH11-PBPC-D25-ST-BK; BUILT_BY: EMA_Cory; COPYRIGHT: Copyright (C) 2018 Accelerated Designs. All rights reserved; MANUFACTURER_PART_NUMBER: SBH11-PBPC-D25-ST-BK; SOURCELIBRARY: Sullins_2020-01-16; VENDOR: Sullins
PROXYM_M1 PROXYM_M2 = SCARA:CON_3F
PT1 = SCARA:POT_2W_5K
R1-R4 R6-R14 R16 R18 R20-R25 R27 R29 = SCARA:R-EU_207/10: RESISTOR, European symbol; SPICEPREFIX: R
R5 = SCARA:OY104KE; BUILT_BY: EMA_UL_Team; MANUFACTURER_PART_NUMBER: OY104KE; SOURCELIBRARY: Ohmite_2015_05_22; VENDOR: Ohmite
R15 R17 R19 R26 R28 = SCARA:64WR5KLF; COPYRIGHT: Copyright (C) 2016 Accelerated Designs. All rights reserved; MANUFACTURER_PART_NUMBER: 64WR5KLF; SOURCELIBRARY: TTELECTRONICS_2018-04-10; VENDOR: TT Electronics
SUP_3V3 SUP_5V = SCARA:BR30X
U1 U2 = SCARA:ULN2003A; BUILT_BY: EMA_UL_Team; MANUFACTURER_PART_NUMBER: ULN2003A; SOURCELIBRARY: Update_to_database_2020-12-04; VENDOR: STMicroelectronics
U3 = SCARA:TMP37FT9Z; BUILT_BY: EMA_UL_Team; MANUFACTURER_PART_NUMBER: TMP37FT9Z; SOURCELIBRARY: Analog_2012-01-01_9; VENDOR: Analog Devices Inc
U4-U7 = SCARA:SN74LS244N; DATASHEET_URL: http://www.ti.com/lit/gpn/SN74LS244; DESCRIPTION: Octal Buffers And Line Drivers With 3-State Outputs; FAMILY_NAME: NON-INVERTING BUFFER/DRIVER; GENERIC_PART_NUMBER: SN74LS244; INDUSTRY_STD_PKG_TYPE: PDIP; MANUFACTURER: Texas Instruments; PACKAGE_DESIGNATOR: N; PIN_COUNT: 20
U8 = SCARA:H11L1M; BUILT_BY: EMA_Justin; COPYRIGHT: Copyright (C) 2018 Accelerated Designs. All rights reserved; DATASHEET: https://www.onsemi.com/pub/Collateral/H11L3M-D.PDF; MANUFACTURER_PART_NUMBER: H11L1M; SOURCELIBRARY: ON_Semiconductor_2020-01-13; VENDOR: ON Semiconductor
U$1-U$12 U$15 = SCARA:LED_TONDO
U$13 = SCARA:C0U12F
U$14 = SCARA:MB6M-E3/45

## Net classes
0 default: width 0.254 mm, clearance 0.254 mm
1 supply: width 0.381 mm, clearance 0.254 mm
2 ground: width 0.381 mm, clearance 0.254 mm
3 high speed: width 0.254 mm, clearance 0.254 mm
4 mid speed: width 0.254 mm, clearance 0.254 mm